# Altium project PX4FMUv2.4.6.PrjPcb (part 1 of 2)
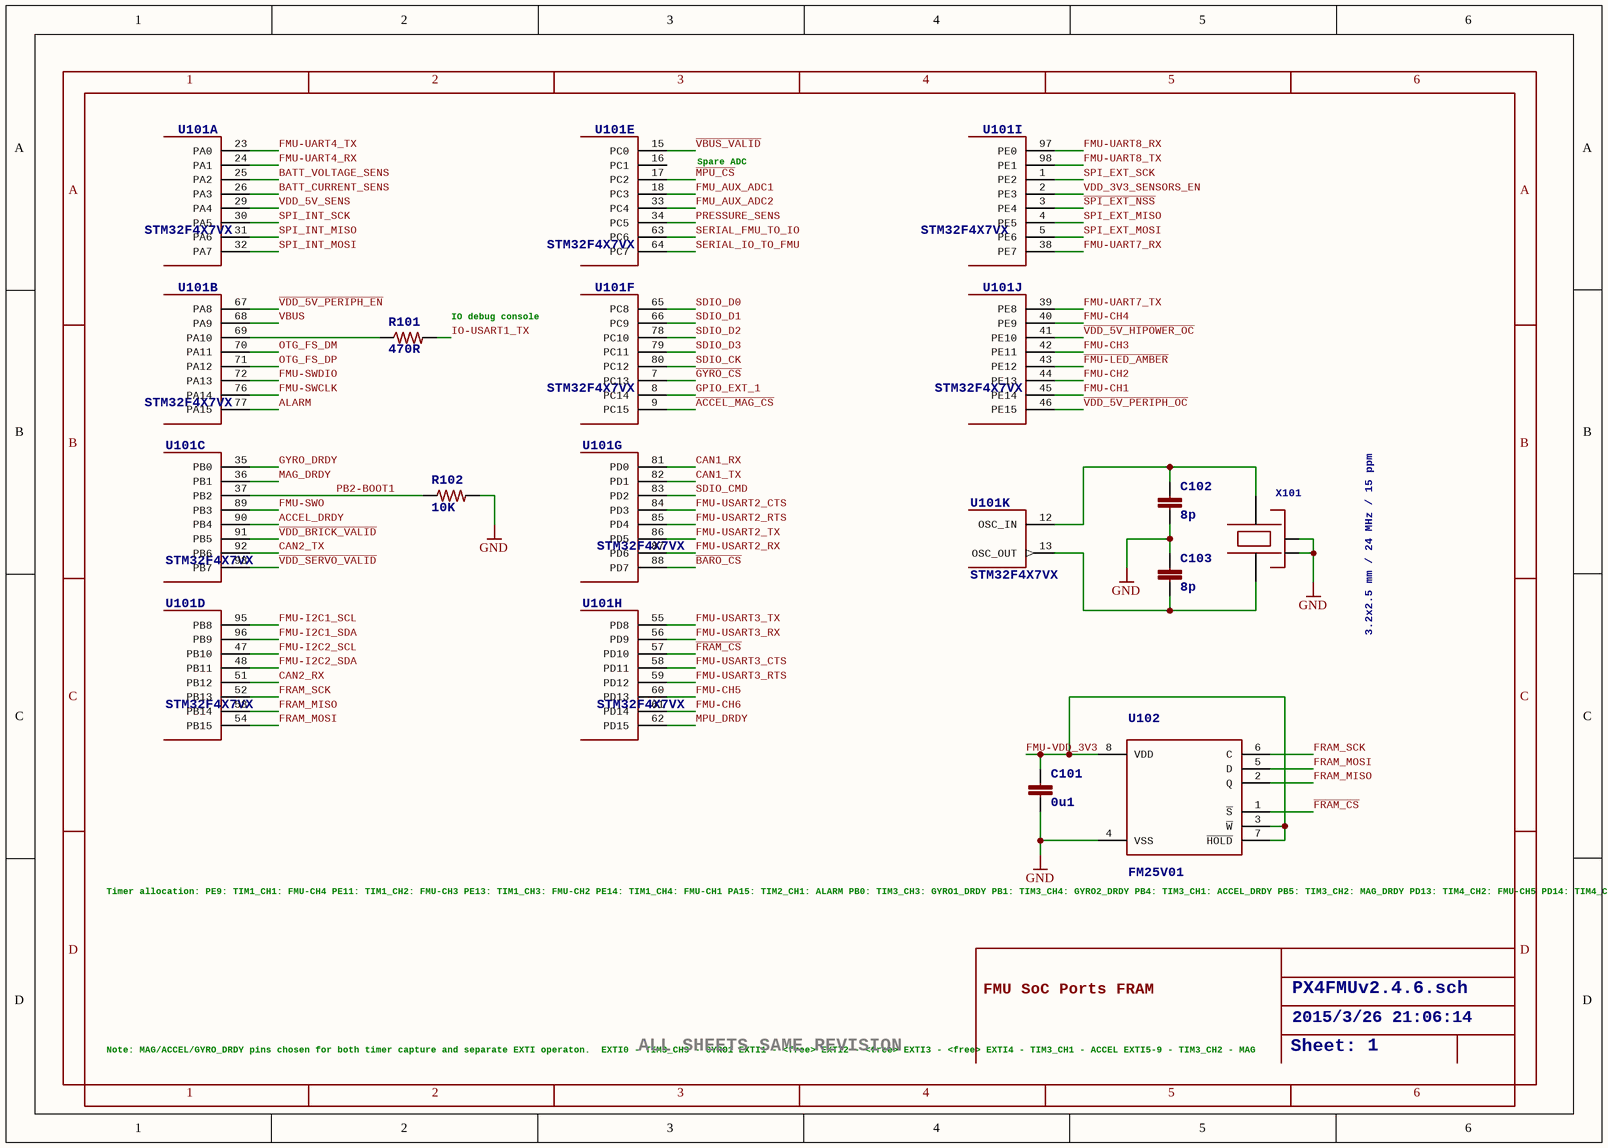
[diagram p0: PX4FMUv2.4.6_01.SchDoc]
12 sheets, 291 parts. Net scope: global (net labels, ports and power ports of the same name join across sheets).
Board file: PX4FMUv2.4.6.PcbDoc
Sheets:
  PX4FMUv2.4.6_01.SchDoc
  PX4FMUv2.4.6_02.SchDoc
  PX4FMUv2.4.6_03.SchDoc
  PX4FMUv2.4.6_04.SchDoc
  PX4FMUv2.4.6_05.SchDoc
  PX4FMUv2.4.6_06.SchDoc
  PX4FMUv2.4.6_07.SchDoc
  PX4FMUv2.4.6_08.SchDoc
  PX4FMUv2.4.6_09.SchDoc
  PX4FMUv2.4.6_10.SchDoc
  PX4FMUv2.4.6_11.SchDoc
  PX4FMUv2.4.6_12.SchDoc

## Sheet PX4FMUv2.4.6_01.SchDoc: PX4FMUv2.4.6.sch
size 282 x 200 mm; Date: 2015/3/26 21:06:14; SheetNumber: Sheet:

### Parts
C101  0u1  [0402-CAP]
C102  8p  [0402-CAP]
C103  8p  [0402-CAP]
R101  470R  [0402-RES]
R102  10K  [0402-RES]
U101  STM32F4X7VX  [TQFP100]  (parts A,B,C,D,E,F,G,H,I,J,K of 14)
U102  FM25V01  [SO08]
X101  3.2x2.5 mm / 24 MHz / 15 ppm  [OSCILLATOR-3.2X2.5]

### Nets
GND: C101.P$2 C102.P$2 C103.P$1 R102.P$2 U102.4(VSS) X101.2(NC_2) X101.4(NC_4)
~{ACCEL_MAG_CS}: U101.9(PC15)
ACCEL_DRDY: U101.90(PB4)
ALARM: U101.77(PA15)
~{BARO_CS}: U101.88(PD7)
BATT_CURRENT_SENS: U101.26(PA3)
BATT_VOLTAGE_SENS: U101.25(PA2)
CAN1_RX: U101.81(PD0)
CAN1_TX: U101.82(PD1)
CAN2_RX: U101.51(PB12)
CAN2_TX: U101.92(PB6)
~{FMU-LED_AMBER}: U101.43(PE12)
~{FRAM_CS}: U101.57(PD10) U102.1(~{S})
FMU-CH1: U101.45(PE14)
FMU-CH2: U101.44(PE13)
FMU-CH3: U101.42(PE11)
FMU-CH4: U101.40(PE9)
FMU-CH5: U101.60(PD13)
FMU-CH6: U101.61(PD14)
FMU-I2C1_SCL: U101.95(PB8)
FMU-I2C1_SDA: U101.96(PB9)
FMU-I2C2_SCL: U101.47(PB10)
FMU-I2C2_SDA: U101.48(PB11)
FMU-SWCLK: U101.76(PA14)
FMU-SWDIO: U101.72(PA13)
FMU-SWO: U101.89(PB3)
FMU-UART4_RX: U101.24(PA1)
FMU-UART4_TX: U101.23(PA0)
FMU-UART7_RX: U101.38(PE7)
FMU-UART7_TX: U101.39(PE8)
FMU-UART8_RX: U101.97(PE0)
FMU-UART8_TX: U101.98(PE1)
FMU-USART2_CTS: U101.84(PD3)
FMU-USART2_RTS: U101.85(PD4)
FMU-USART2_RX: U101.87(PD6)
FMU-USART2_TX: U101.86(PD5)
FMU-USART3_CTS: U101.58(PD11)
FMU-USART3_RTS: U101.59(PD12)
FMU-USART3_RX: U101.56(PD9)
FMU-USART3_TX: U101.55(PD8)
FMU-VDD_3V3: C101.P$1 U102.3(~{W}) U102.7(~{HOLD}) U102.8(VDD)
FMU_AUX_ADC1: U101.18(PC3)
FMU_AUX_ADC2: U101.33(PC4)
FRAM_MISO: U101.53(PB14) U102.2(Q)
FRAM_MOSI: U101.54(PB15) U102.5(D)
FRAM_SCK: U101.52(PB13) U102.6(C)
~{GYRO_CS}: U101.7(PC13)
GPIO_EXT_1: U101.8(PC14)
GYRO_DRDY: U101.35(PB0)
IO-USART1_TX: R101.P$2
~{MPU_CS}: U101.17(PC2)
MAG_DRDY: U101.36(PB1)
MPU_DRDY: U101.62(PD15)
OTG_FS_DM: U101.70(PA11)
OTG_FS_DP: U101.71(PA12)
PB2-BOOT1: R102.P$1 U101.37(PB2)
PRESSURE_SENS: U101.34(PC5)
~{SPI_EXT_NSS}: U101.3(PE4)
SDIO_CK: U101.80(PC12)
SDIO_CMD: U101.83(PD2)
SDIO_D0: U101.65(PC8)
SDIO_D1: U101.66(PC9)
SDIO_D2: U101.78(PC10)
SDIO_D3: U101.79(PC11)
SERIAL_FMU_TO_IO: U101.63(PC6)
SERIAL_IO_TO_FMU: U101.64(PC7)
SPI_EXT_MISO: U101.4(PE5)
SPI_EXT_MOSI: U101.5(PE6)
SPI_EXT_SCK: U101.1(PE2)
SPI_INT_MISO: U101.31(PA6)
SPI_INT_MOSI: U101.32(PA7)
SPI_INT_SCK: U101.30(PA5)
~{VBUS_VALID}: U101.15(PC0)
~{VDD_5V_HIPOWER_OC}: U101.41(PE10)
~{VDD_5V_PERIPH_EN}: U101.67(PA8)
~{VDD_5V_PERIPH_OC}: U101.46(PE15)
~{VDD_BRICK_VALID}: U101.91(PB5)
~{VDD_SERVO_VALID}: U101.93(PB7)
VBUS: U101.68(PA9)
VDD_3V3_SENSORS_EN: U101.2(PE3)
VDD_5V_SENS: U101.29(PA4)
NetC102_P$1: C102.P$1 U101.12(OSC_IN) X101.3
NetC103_P$2: C103.P$2 U101.13(OSC_OUT) X101.1
NetR101_P$1: R101.P$1 U101.69(PA10)

Not connected (* = marked no-connect by the designer): U101 16(PC1)

### Notes on the sheet
- Spare ADC
- (near R101) IO debug console
- (near U102) Timer allocation:
  PE9: TIM1_CH1: FMU-CH4
  PE11: TIM1_CH2: FMU-CH3
  PE13: TIM1_CH3: FMU-CH2
  PE14: TIM1_CH4: FMU-CH1
  PA15: TIM2_CH1: ALARM
  PB0: TIM3_CH3: GYRO1_DRDY
  PB1: TIM3_CH4: GYRO2_DRDY
  PB4: TIM3_CH1: ACCEL_DRDY
  PB5: TIM3_CH2: MAG_DRDY
  PD13: TIM4_CH2: FMU-CH5
  PD14: TIM4_CH3: FMU-CH6
  PD15: TIM4_CH4: spare
- FMU SoC Ports
  FRAM
- Note: MAG/ACCEL/GYRO_DRDY pins chosen
  for both timer capture and separate
  EXTI operaton.
  EXTI0 - TIM3_CH3 - GYRO1
  EXTI1 - <free>
  EXTI2 - <free>
  EXTI3 - <free>
  EXTI4 - TIM3_CH1 - ACCEL
  EXTI5-9 - TIM3_CH2 - MAG
- ALL SHEETS SAME REVISION
- 1
- 2
- 3
- 4
- 5
- 6
- A
- B
- C
- D

### Library data of the parts
C101 = CAP0402: <b>Capacitor</b> / Standard 0603 ceramic capacitor, and 0.1" leaded capacitor.; PARTNO: CC0402ZRY5V7BB104
C102 C103 = CAP0402: <b>Capacitor</b> / Standard 0603 ceramic capacitor, and 0.1" leaded capacitor.; PARTNO: C1005C0G1H080C
R101 = RESISTOR0402-RES: <b>Resistor</b> / Basic schematic elements and footprints for 0603, 1206, and PTH 1/10th watt (small) resistors.; PARTNO: RC0402FR-07470RL
R102 = RESISTOR0402-RES: <b>Resistor</b> / Basic schematic elements and footprints for 0603, 1206, and PTH 1/10th watt (small) resistors.; PARTNO: RC0402FR-0710KL
U101 = STM32F4X7VX: STM32F4X7VX 100 pin LQFP / STM32F407VE - 512 KB flash, no crypto / STM32F407VG - 1 MB flash, no crypto / STM32F417VE - 512 KB flash, with crypto / STM32F417VG - 1 MB flash, with crypto; PARTNO: STM32F427VI
U102 = FM25V01: <b>FM25V01 128Kb Serial 3V F-RAM Memory</b>; PARTNO: FM25V01-G; DATASHEET: http://www.ramtron.com/files/datasheets/FM25V01_ds.pdf; LINK: http://www.digikey.com/product-detail/en/FM25V01-GTR/1140-1026-1-ND/2809832; MFGPN: FM25V01
X101 = OSCILLATOR-3.2X2.5: Crystal Oscillator in 3.2x2.5 SMD

## Sheet PX4FMUv2.4.6_02.SchDoc: PX4FMUv2.4.6.sch
size 282 x 200 mm; Date: 2015/3/26 21:06:15; SheetNumber: Sheet:
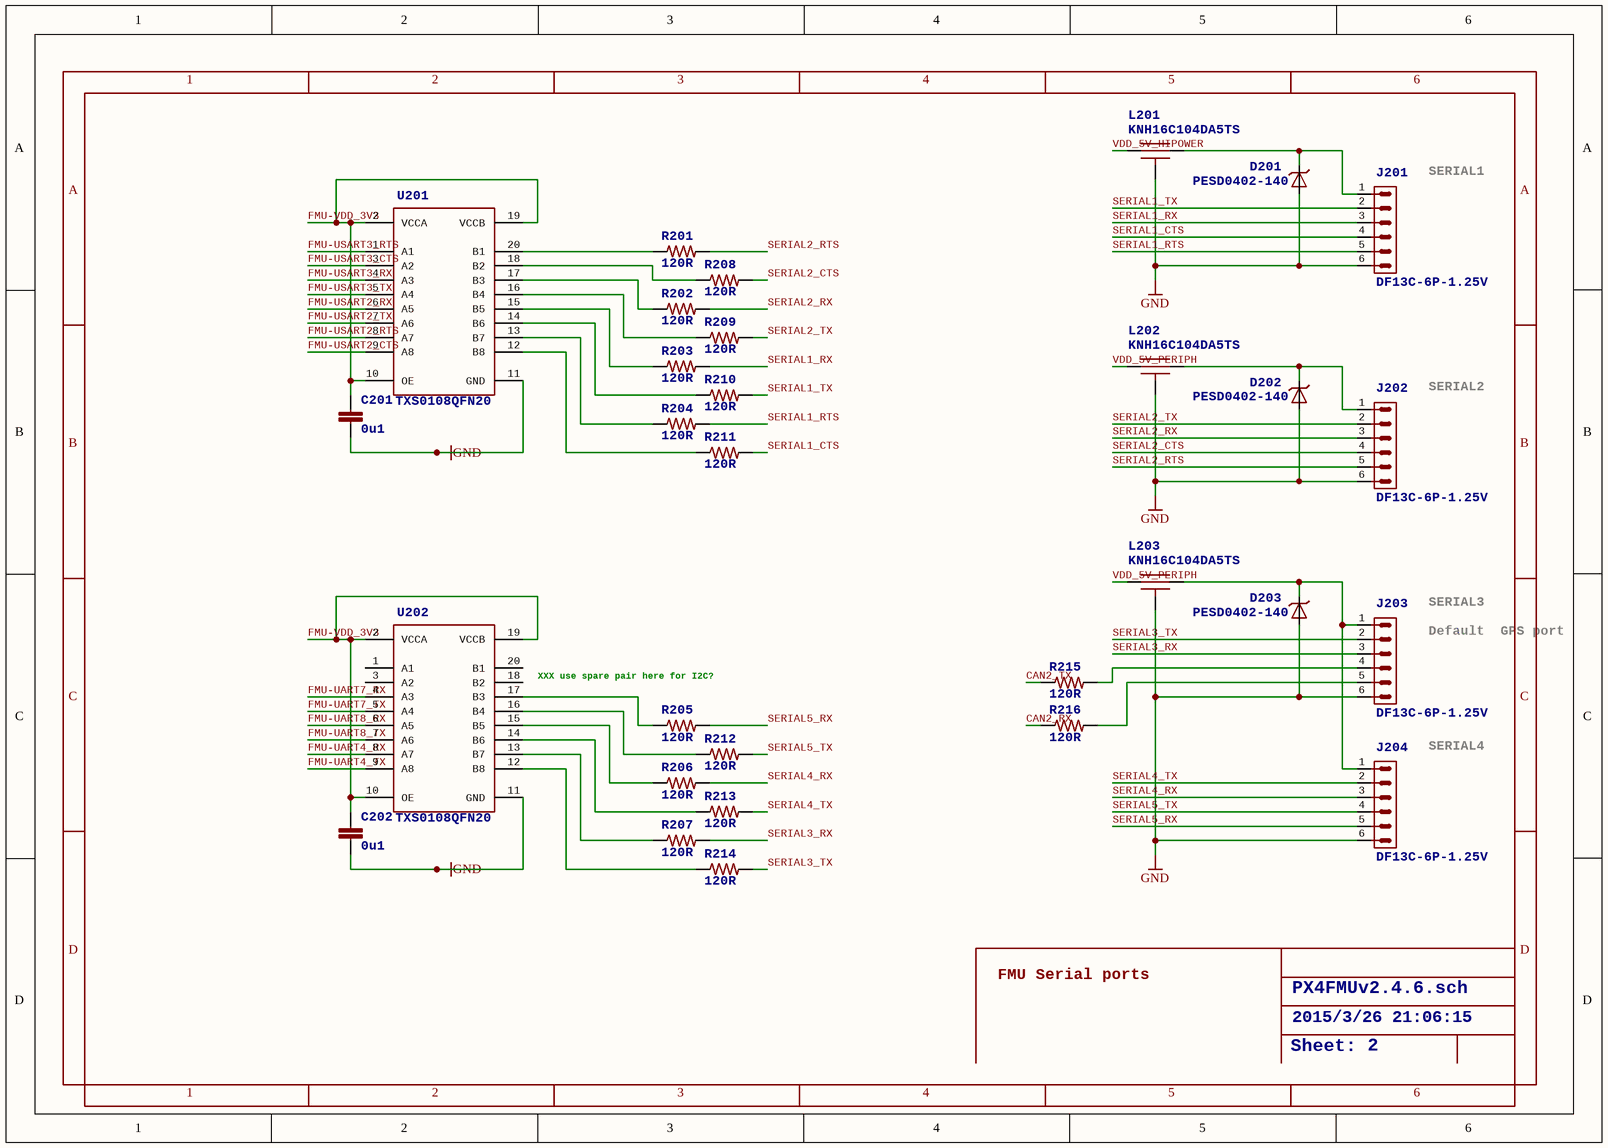
[diagram p1: PX4FMUv2.4.6_02.SchDoc]

### Parts
C201  0u1  [0402-CAP]
C202  0u1  [0402-CAP]
D201  PESD0402-140  [0402-TVS]
D202  PESD0402-140  [0402-TVS]
D203  PESD0402-140  [0402-TVS]
J201  DF13C-6P-1.25V  [DF13C-6P-1.25V]
J202  DF13C-6P-1.25V  [DF13C-6P-1.25V]
J203  DF13C-6P-1.25V  [DF13C-6P-1.25V]
J204  DF13C-6P-1.25V  [DF13C-6P-1.25V]
L201  KNH16C104DA5TS  [KYOCERA-KNH16-DA]
L202  KNH16C104DA5TS  [KYOCERA-KNH16-DA]
L203  KNH16C104DA5TS  [KYOCERA-KNH16-DA]
R201  120R  [0402-RES]
R202  120R  [0402-RES]
R203  120R  [0402-RES]
R204  120R  [0402-RES]
R205  120R  [0402-RES]
R206  120R  [0402-RES]
R207  120R  [0402-RES]
R208  120R  [0402-RES]
R209  120R  [0402-RES]
R210  120R  [0402-RES]
R211  120R  [0402-RES]
R212  120R  [0402-RES]
R213  120R  [0402-RES]
R214  120R  [0402-RES]
R215  120R  [0402-RES]
R216  120R  [0402-RES]
U201  TXS0108QFN20  [QFN20-RGY]
U202  TXS0108QFN20  [QFN20-RGY]

### Nets
GND: C201.P$2 C202.P$2 D201.A D202.A D203.A J201.6 J202.6 J203.6 J204.6 L201.P$3_P$4_P$5(P$3) L202.P$3_P$4_P$5(P$3) L203.P$3_P$4_P$5(P$3) U201.11(GND) U202.11(GND)
CAN2_RX: R216.P$1
CAN2_TX: R215.P$1
FMU-UART4_RX: U202.8(A7)
FMU-UART4_TX: U202.9(A8)
FMU-UART7_RX: U202.4(A3)
FMU-UART7_TX: U202.5(A4)
FMU-UART8_RX: U202.6(A5)
FMU-UART8_TX: U202.7(A6)
FMU-USART2_CTS: U201.9(A8)
FMU-USART2_RTS: U201.8(A7)
FMU-USART2_RX: U201.6(A5)
FMU-USART2_TX: U201.7(A6)
FMU-USART3_CTS: U201.3(A2)
FMU-USART3_RTS: U201.1(A1)
FMU-USART3_RX: U201.4(A3)
FMU-USART3_TX: U201.5(A4)
FMU-VDD_3V3: C201.P$1 C202.P$1 U201.2(VCCA) U201.10(OE) U201.19(VCCB) U202.2(VCCA) U202.10(OE) U202.19(VCCB)
SERIAL1_CTS: J201.4 R211.P$2
SERIAL1_RTS: J201.5 R204.P$2
SERIAL1_RX: J201.3 R203.P$2
SERIAL1_TX: J201.2 R210.P$2
SERIAL2_CTS: J202.4 R208.P$2
SERIAL2_RTS: J202.5 R201.P$2
SERIAL2_RX: J202.3 R202.P$2
SERIAL2_TX: J202.2 R209.P$2
SERIAL3_RX: J203.3 R207.P$2
SERIAL3_TX: J203.2 R214.P$2
SERIAL4_RX: J204.3 R206.P$2
SERIAL4_TX: J204.2 R213.P$2
SERIAL5_RX: J204.5 R205.P$2
SERIAL5_TX: J204.4 R212.P$2
VDD_5V_HIPOWER: L201.P$1
VDD_5V_PERIPH: L202.P$1 L203.P$1
NetD201_C: D201.C J201.1 L201.P$2
NetD202_C: D202.C J202.1 L202.P$2
NetD203_C: D203.C J203.1 J204.1 L203.P$2
NetJ203_4: J203.4 R215.P$2
NetJ203_5: J203.5 R216.P$2
NetR201_P$1: R201.P$1 U201.20(B1)
NetR202_P$1: R202.P$1 U201.17(B3)
NetR203_P$1: R203.P$1 U201.15(B5)
NetR204_P$1: R204.P$1 U201.13(B7)
NetR205_P$1: R205.P$1 U202.17(B3)
NetR206_P$1: R206.P$1 U202.15(B5)
NetR207_P$1: R207.P$1 U202.13(B7)
NetR208_P$1: R208.P$1 U201.18(B2)
NetR209_P$1: R209.P$1 U201.16(B4)
NetR210_P$1: R210.P$1 U201.14(B6)
NetR211_P$1: R211.P$1 U201.12(B8)
NetR212_P$1: R212.P$1 U202.16(B4)
NetR213_P$1: R213.P$1 U202.14(B6)
NetR214_P$1: R214.P$1 U202.12(B8)

Not connected (* = marked no-connect by the designer): U202 1(A1) 3(A2) 18(B2) 20(B1)

### Notes on the sheet
- SERIAL1
- SERIAL2
- SERIAL3
- Default
  GPS port
- XXX use spare pair here for I2C?
- SERIAL4
- FMU Serial ports
- 1
- 2
- 3
- 4
- 5
- 6
- A
- B
- C
- D

### Library data of the parts
C201 C202 = CAP0402: as C101 on sheet PX4FMUv2.4.6_01
D201-D203 = DIODE-TVS
J201-J204 = DF13-6P-1.25V: DF13-6P / 1.25mm Pitch Miniature Crimping Connector.; PARTNO: DF13C-6P-1.25V(20)
L201-L203 = KNH16C104DA5TS: Kyocera KNH16C104DA5TS EMI filter; PARTNO: KNH16C104DA5TS
R201-R216 = RESISTOR0402-RES: <b>Resistor</b> / Basic schematic elements and footprints for 0603, 1206, and PTH 1/10th watt (small) resistors.; PARTNO: RC0402FR-07120RL
U201 U202 = TXS0108QFN20: PARTNO: TXS0108ERGYR

## Sheet PX4FMUv2.4.6_03.SchDoc: PX4FMUv2.4.6.sch
size 282 x 200 mm; Date: 2015/3/26 21:06:16; SheetNumber: Sheet:
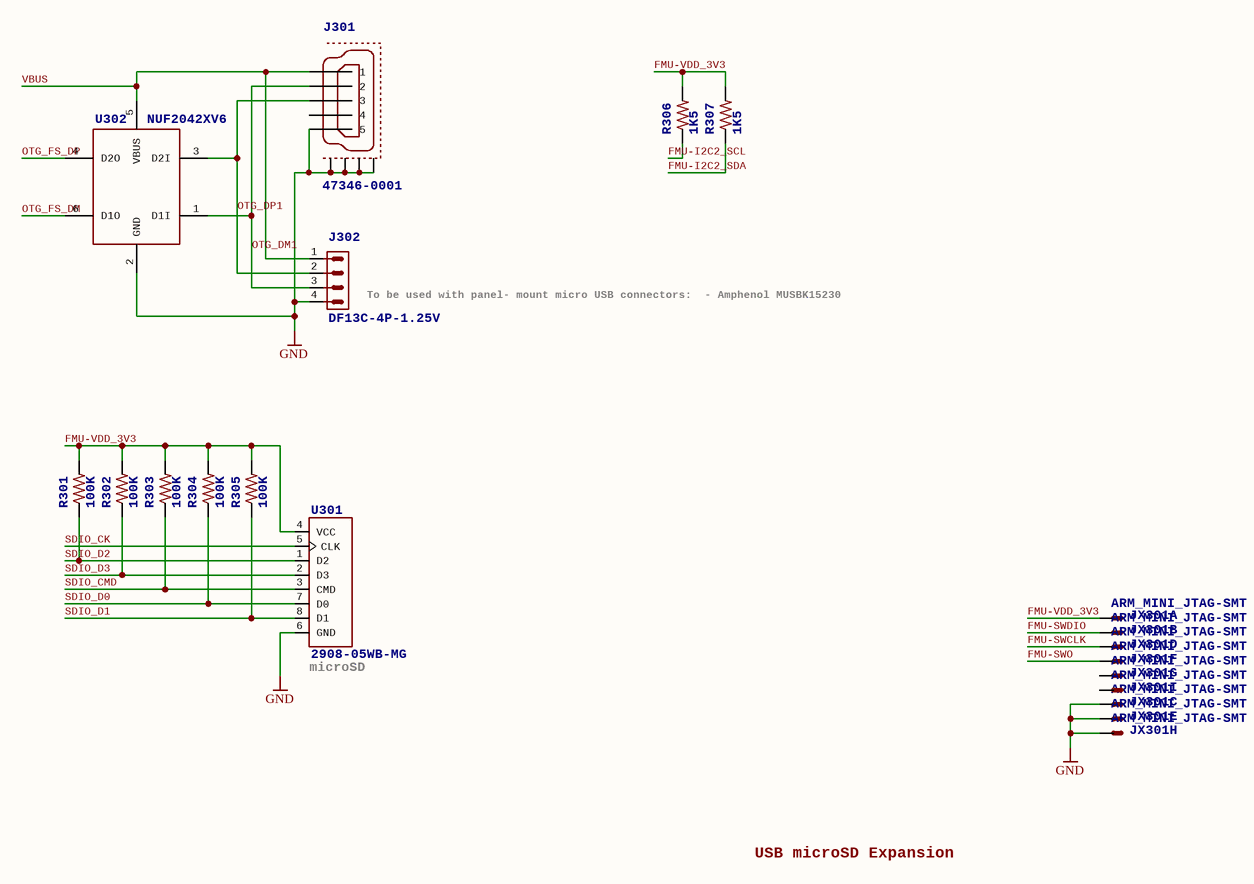
[diagram p2: PX4FMUv2.4.6_03.SchDoc]

### Parts
J301  47346-0001  [MOLEX-47346-0001]
J302  DF13C-4P-1.25V  [DF13C-4P-1.25V]
JX301  ARM_MINI_JTAG-SMT  [FTSH-105-01-XXX-DV-K]  (parts A,B,C,D,E,F,G,H,I of 9)
R301  100K  [0402-RES]
R302  100K  [0402-RES]
R303  100K  [0402-RES]
R304  100K  [0402-RES]
R305  100K  [0402-RES]
R306  1K5  [0402-RES]
R307  1K5  [0402-RES]
U301  2908-05WB-MG  [MICROSD]
U302  NUF2042XV6  [SOT563-6]

### Nets
GND: J301.GND(5) J301.GND1 J301.GND2 J301.GND3 J301.GND4 J302.4 JX301.3(S) JX301.5(S) JX301.9(S) U301.6(GND) U302.2(GND)
FMU-I2C2_SCL: R306.P$1
FMU-I2C2_SDA: R307.P$1
FMU-SWCLK: JX301.4(S)
FMU-SWDIO: JX301.2(S)
FMU-SWO: JX301.6(S)
FMU-VDD_3V3: JX301.1(S) R301.P$2 R302.P$2 R303.P$2 R304.P$2 R305.P$2 R306.P$2 R307.P$2 U301.4(VCC)
OTG_DM1: J301.D-(2) J302.3 U302.1(D1I)
OTG_DP1: J301.D+(3) J302.2 U302.3(D2I)
OTG_FS_DM: U302.6(D1O)
OTG_FS_DP: U302.4(D2O)
SDIO_CK: U301.5(CLK)
SDIO_CMD: R303.P$1 U301.3(CMD)
SDIO_D0: R304.P$1 U301.7(D0)
SDIO_D1: R305.P$1 U301.8(D1)
SDIO_D2: R301.P$1 U301.1(D2)
SDIO_D3: R302.P$1 U301.2(D3)
VBUS: J301.VBUS(1) J302.1 U302.5(VBUS)

Not connected (* = marked no-connect by the designer): J301 ID(4); JX301 8(S) 10(S)

### Notes on the sheet
- (near J302) To be used with panel-
  mount micro USB connectors:
  - Amphenol MUSBK15230
- (near U301) microSD
- USB
  microSD
  Expansion
- 1
- 2
- 3
- 4
- 5
- 6
- A
- B
- C
- D

### Library data of the parts
J301 = MOLEX-47346-0001: MICRO USB B, BOTTOM MOUNT
J302 = DF13-4P-1.25V: DF13-4P / 1.25mm Pitch Miniature Crimping Connector.; PARTNO: DF13C-4P-1.25V(20)
JX301 = ARM_MINI_JTAG-SMT: <b>CONNECTOR</b><p> / wire to board 1.25 mm (.049 inch) pitch header; PARTNO: M50-3900542; BOM: EXCLUDE
R301-R305 = RESISTOR0402-RES: <b>Resistor</b> / Basic schematic elements and footprints for 0603, 1206, and PTH 1/10th watt (small) resistors.; PARTNO: RC0402FR-07100KL
R306 R307 = RESISTOR0402-RES: <b>Resistor</b> / Basic schematic elements and footprints for 0603, 1206, and PTH 1/10th watt (small) resistors.; PARTNO: RC0402FR-071K5L
U301 = MICROSDSDI: PARTNO: 2908-05WB-MG
U302 = NUF2042XV6: PARTNO: NUF2042XV6T1G

## Sheet PX4FMUv2.4.6_04.SchDoc: PX4FMUv2.4.6.sch
size 282 x 200 mm; Date: 2015/3/26 21:06:17; SheetNumber: Sheet:
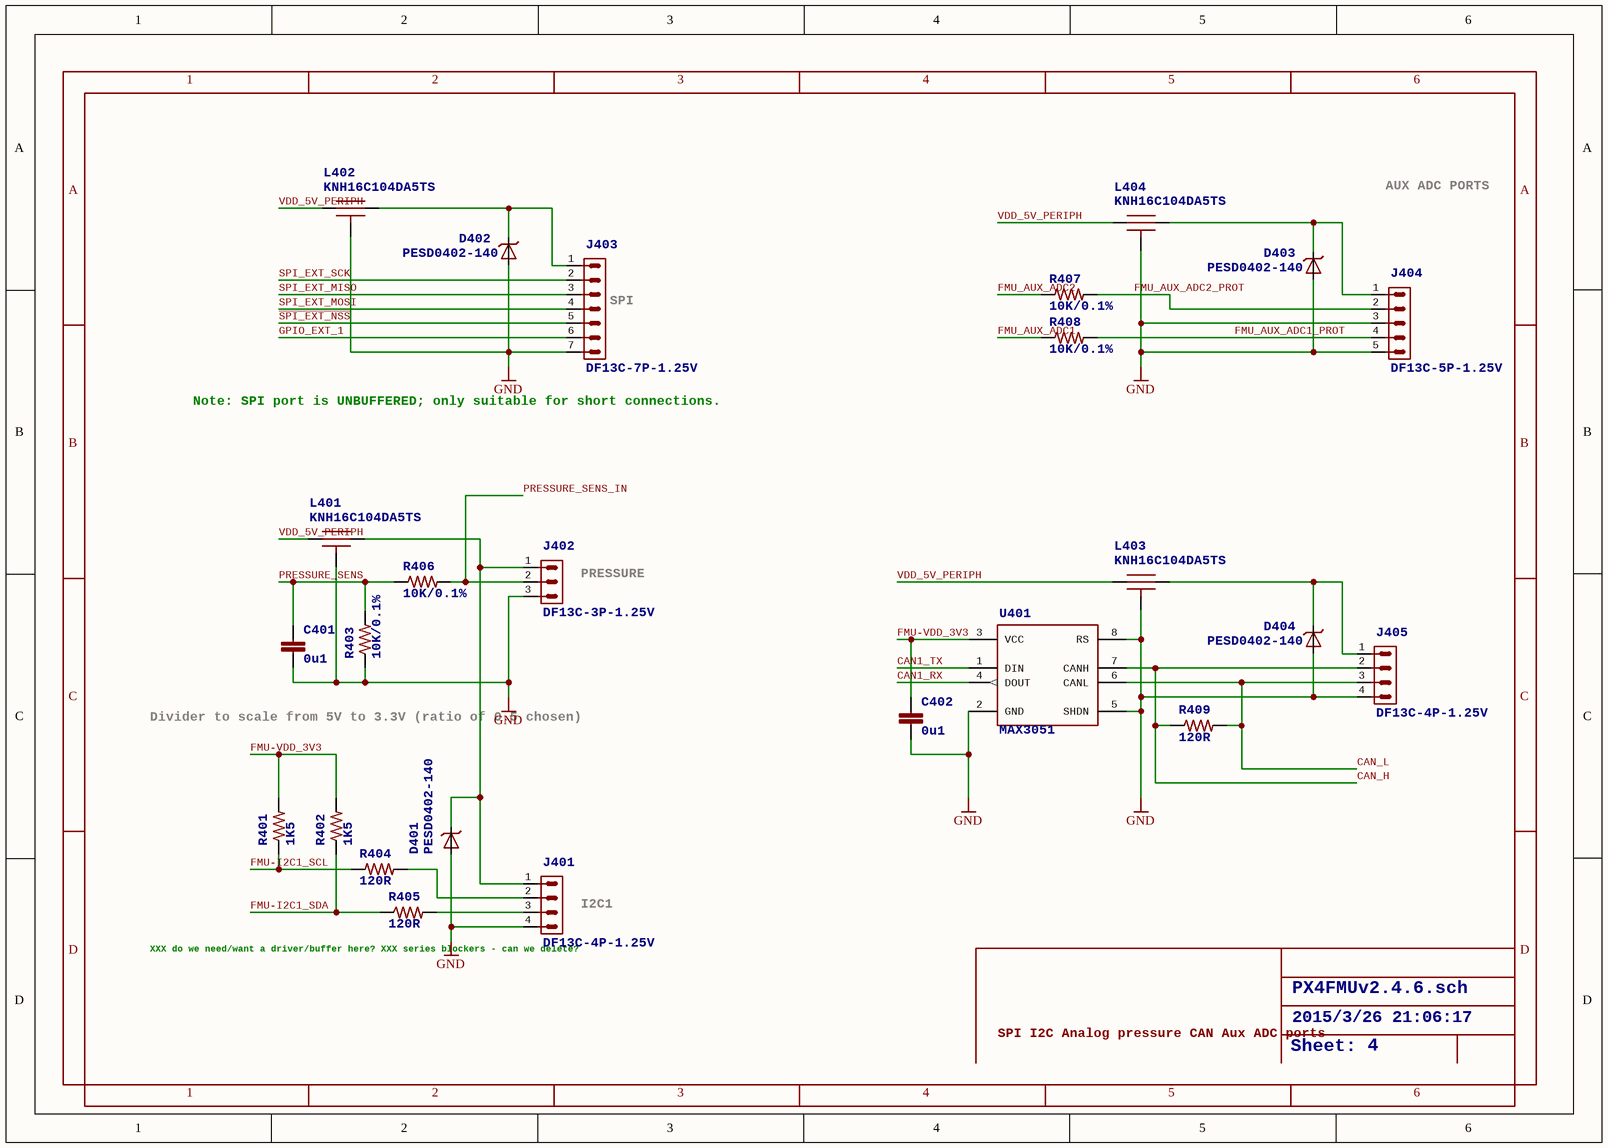
[diagram p3: PX4FMUv2.4.6_04.SchDoc]

### Parts
C401  0u1  [0402-CAP]
C402  0u1  [0402-CAP]
D401  PESD0402-140  [0402-TVS]
D402  PESD0402-140  [0402-TVS]
D403  PESD0402-140  [0402-TVS]
D404  PESD0402-140  [0402-TVS]
J401  DF13C-4P-1.25V  [DF13C-4P-1.25V]
J402  DF13C-3P-1.25V  [DF13C-3P-1.25V]
J403  DF13C-7P-1.25V  [DF13C-7P-1.25V]
J404  DF13C-5P-1.25V  [DF13C-5P-1.25V]
J405  DF13C-4P-1.25V  [DF13C-4P-1.25V]
L401  KNH16C104DA5TS  [KYOCERA-KNH16-DA]
L402  KNH16C104DA5TS  [KYOCERA-KNH16-DA]
L403  KNH16C104DA5TS  [KYOCERA-KNH16-DA]
L404  KNH16C104DA5TS  [KYOCERA-KNH16-DA]
R401  1K5  [0402-RES]
R402  1K5  [0402-RES]
R403  10K/0.1%  [0402-RES]
R404  120R  [0402-RES]
R405  120R  [0402-RES]
R406  10K/0.1%  [0402-RES]
R407  10K/0.1%  [0402-RES]
R408  10K/0.1%  [0402-RES]
R409  120R  [0402-RES]
U401  MAX3051  [SOT23-8]

### Nets
GND: C401.P$2 C402.P$2 D401.A D402.A D403.A D404.A J401.4 J402.3 J403.7 J404.3 J404.5 J405.4 L401.P$3_P$4_P$5(P$3) L402.P$3_P$4_P$5(P$3) L403.P$3_P$4_P$5(P$3) L404.P$3_P$4_P$5(P$3) R403.P$1 U401.2(GND) U401.5(SHDN) U401.8(RS)
CAN1_RX: U401.4(DOUT)
CAN1_TX: U401.1(DIN)
CAN_H: J405.2 R409.P$1 U401.7(CANH)
CAN_L: J405.3 R409.P$2 U401.6(CANL)
FMU-I2C1_SCL: R401.P$1 R404.P$1
FMU-I2C1_SDA: R402.P$1 R405.P$1
FMU-VDD_3V3: C402.P$1 R401.P$2 R402.P$2 U401.3(VCC)
FMU_AUX_ADC1: R408.P$1
FMU_AUX_ADC1_PROT: J404.4 R408.P$2
FMU_AUX_ADC2: R407.P$1
FMU_AUX_ADC2_PROT: J404.2 R407.P$2
GPIO_EXT_1: J403.6
PRESSURE_SENS: C401.P$1 R403.P$2 R406.P$1
PRESSURE_SENS_IN: J402.2 R406.P$2
~{SPI_EXT_NSS}: J403.5
SPI_EXT_MISO: J403.3
SPI_EXT_MOSI: J403.4
SPI_EXT_SCK: J403.2
VDD_5V_PERIPH: L401.P$1 L402.P$1 L403.P$1 L404.P$1
NetD401_C: D401.C J401.1 J402.1 L401.P$2
NetD402_C: D402.C J403.1 L402.P$2
NetD403_C: D403.C J404.1 L404.P$2
NetD404_C: D404.C J405.1 L403.P$2
NetJ401_2: J401.2 R404.P$2
NetJ401_3: J401.3 R405.P$2

### Notes on the sheet
- AUX ADC PORTS
- (near J403) SPI
- (near J403) Note: SPI port is UNBUFFERED; only suitable for short connections.
- (near J402) PRESSURE
- Divider to scale from 5V to 3.3V
  (ratio of 0.5 chosen)
- XXX do we need/want a driver/buffer here?
  XXX series blockers - can we delete?
- (near J401) I2C1
- SPI
  I2C
  Analog pressure
  CAN
  Aux ADC ports
- 1
- 2
- 3
- 4
- 5
- 6
- A
- B
- C
- D

### Library data of the parts
C401 C402 = CAP0402: as C101 on sheet PX4FMUv2.4.6_01
D401-D404 = DIODE-TVS
J401 J405 = DF13-4P-1.25V: as J302 on sheet PX4FMUv2.4.6_03
J402 = DF13-3P-1.25V: DF13-3P / 1.25mm Pitch Miniature Crimping Connector.; PARTNO: DF13C-3P-1.25V(20)
J403 = DF13-7P-1.25V: DF13-7P / 1.25mm Pitch Miniature Crimping Connector.; PARTNO: DF13C-7P-1.25V(20)
J404 = DF13-5P-1.25V: DF13-5P / 1.25mm Pitch Miniature Crimping Connector.; PARTNO: DF13C-5P-1.25V(20)
L401-L404 = KNH16C104DA5TS: Kyocera KNH16C104DA5TS EMI filter; PARTNO: KNH16C104DA5TS
R401 R402 = RESISTOR0402-RES: as R306 on sheet PX4FMUv2.4.6_03
R403 R406-R408 = RESISTOR0402-RES: <b>Resistor</b> / Basic schematic elements and footprints for 0603, 1206, and PTH 1/10th watt (small) resistors.; PARTNO: ERA-2AEB103X
R404 R405 R409 = RESISTOR0402-RES: as R201 on sheet PX4FMUv2.4.6_02
U401 = MAX3051MAX3051EKA: 3.3-V CAN TRANSCEIVER; PARTNO: MAX3051EKA

## Sheet PX4FMUv2.4.6_05.SchDoc: PX4FMUv2.4.6.sch
size 282 x 200 mm; Date: 2015/3/26 21:06:18; SheetNumber: Sheet:
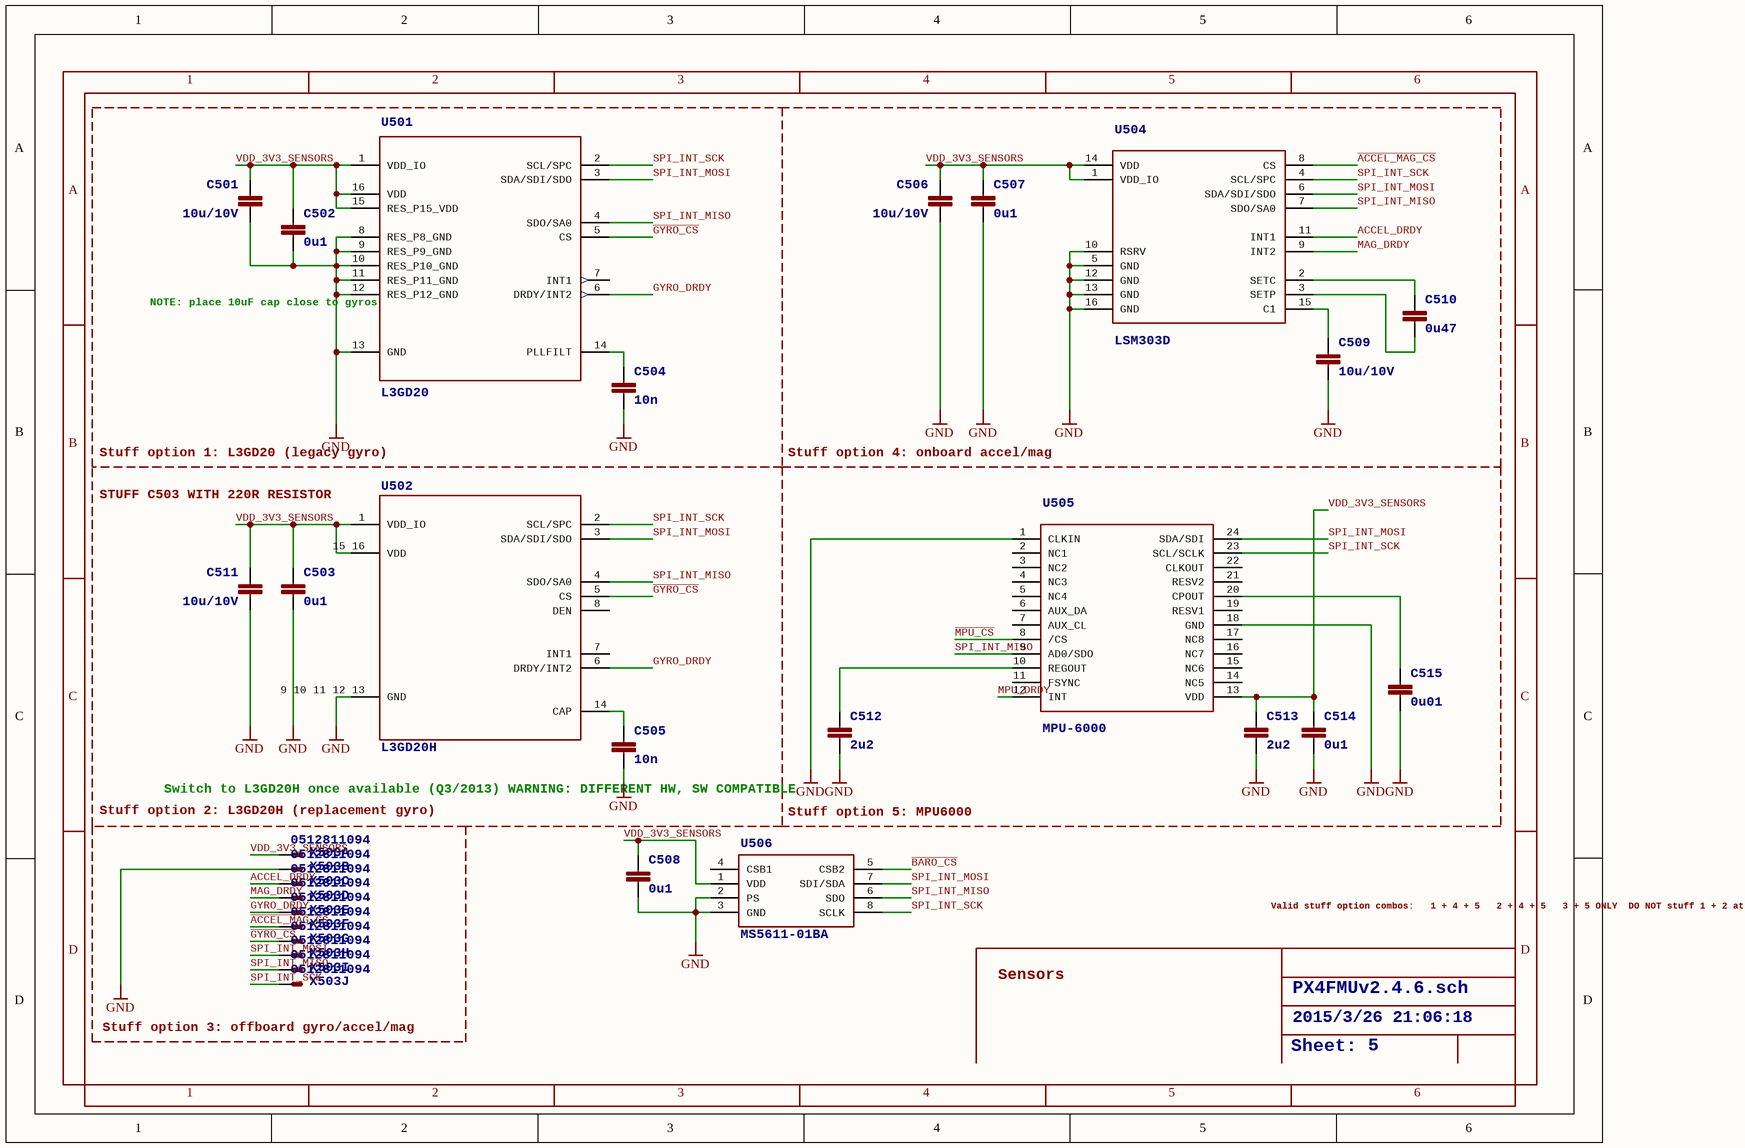
[diagram p4: PX4FMUv2.4.6_05.SchDoc]

### Parts
C501  10u/10V  [0805-CAP]
C502  0u1  [0402-CAP]
C503  0u1  [0402-CAP]
C504  10n  [0402-CAP]
C505  10n  [0402-CAP]
C506  10u/10V  [0805-CAP]
C507  0u1  [0402-CAP]
C508  0u1  [0402-CAP]
C509  10u/10V  [0805-CAP]
C510  0u47  [0402-CAP]
C511  10u/10V  [0805-CAP]
C512  2u2  [0603-CAP]
C513  2u2  [0603-CAP]
C514  0u1  [0402-CAP]
C515  0u01  [0603-CAP]
U501  L3GD20  [L3G4200DH-MAN]
U502  L3GD20H  [LGA-16L]
U504  LSM303D  [LGA-16L]
U505  MPU-6000  [QFN-24]
U506  MS5611-01BA  [MS5611-01BA]
X503  0512811094  [51281-1094]  (parts A,B,C,D,E,F,G,H,I,J of 10)

### Nets
GND: C501.P$2 C502.P$2 C503.P$2 C504.P$2 C505.P$2 C506.P$2 C507.P$2 C508.P$2 C509.P$2 C511.P$2 C512.P$2 C513.P$2 C514.P$2 C515.P$2 U501.8(RES_P8_GND) U501.9(RES_P9_GND) U501.10(RES_P10_GND) U501.11(RES_P11_GND) U501.12(RES_P12_GND) U501.13(GND) U502.9_10_11_12_13(GND) U504.5(GND) U504.10(RSRV) U504.12(GND) U504.13(GND) U504.16(GND) U505.1(CLKIN) U505.18(GND) U506.2(PS) U506.3(GND) X503.2(S)
~{ACCEL_MAG_CS}: U504.8(CS) X503.6(S)
ACCEL_DRDY: U504.11(INT1) X503.3(S)
~{BARO_CS}: U506.5(CSB2)
~{GYRO_CS}: U501.5(CS) U502.5(CS) X503.7(S)
GYRO_DRDY: U501.6(DRDY/INT2) U502.6(DRDY/INT2) X503.5(S)
~{MPU_CS}: U505.8(/CS)
MAG_DRDY: U504.9(INT2) X503.4(S)
MPU_DRDY: U505.12(INT)
SPI_INT_MISO: U501.4(SDO/SA0) U502.4(SDO/SA0) U504.7(SDO/SA0) U505.9(AD0/SDO) U506.6(SDO) X503.9(S)
SPI_INT_MOSI: U501.3(SDA/SDI/SDO) U502.3(SDA/SDI/SDO) U504.6(SDA/SDI/SDO) U505.24(SDA/SDI) U506.7(SDI/SDA) X503.8(S)
SPI_INT_SCK: U501.2(SCL/SPC) U502.2(SCL/SPC) U504.4(SCL/SPC) U505.23(SCL/SCLK) U506.8(SCLK) X503.10(S)
VDD_3V3_SENSORS: C501.P$1 C502.P$1 C503.P$1 C506.P$1 C507.P$1 C508.P$1 C511.P$1 C513.P$1 C514.P$1 U501.1(VDD_IO) U501.15(RES_P15_VDD) U501.16(VDD) U502.1(VDD_IO) U502.15_16(VDD) U504.1(VDD_IO) U504.14(VDD) U505.13(VDD) U506.1(VDD) X503.1(S)
NetC504_P$1: C504.P$1 U501.14(PLLFILT)
NetC505_P$1: C505.P$1 U502.14(CAP)
NetC509_P$1: C509.P$1 U504.15(C1)
NetC510_P$1: C510.P$1 U504.2(SETC)
NetC510_P$2: C510.P$2 U504.3(SETP)
NetC512_P$1: C512.P$1 U505.10(REGOUT)
NetC515_P$1: C515.P$1 U505.20(CPOUT)

Not connected (* = marked no-connect by the designer): U501 7(INT1); U502 7(INT1) 8(DEN); U505 2(NC1) 3(NC2) 4(NC3) 5(NC4) 6(AUX_DA) 7(AUX_CL) 11(FSYNC) 14(NC5) 15(NC6) 16(NC7) 17(NC8) 19(RESV1) 21(RESV2) 22(CLKOUT); U506 4(CSB1)

### Notes on the sheet
- NOTE: place 10uF cap
  close to gyros
- Stuff option 1: L3GD20 (legacy gyro)
- STUFF C503 WITH 220R RESISTOR
- Stuff option 4: onboard accel/mag
- (near C505) Switch to L3GD20H
  once available (Q3/2013)
  WARNING: DIFFERENT HW,
  SW COMPATIBLE
- (near X503) Stuff option 2: L3GD20H (replacement gyro)
- Stuff option 5: MPU6000
- Valid stuff option combos:
  1 + 4 + 5
  2 + 4 + 5
  3 + 5 ONLY
  DO NOT stuff 1 + 2 at the same time
  DO NOT stuff 3 with any of 1, 2 or 4
- Sensors
- (near X503) Stuff option 3: offboard gyro/accel/mag
- 1
- 2
- 3
- 4
- 5
- 6
- A
- B
- C
- D

### Library data of the parts
C501 C506 C509 C511 = CAP0805: <b>Capacitor</b> / Standard 0603 ceramic capacitor, and 0.1" leaded capacitor.; PARTNO: CC0805ZKY5V6BB106
C502 C503 C507 C508 C514 = CAP0402: as C101 on sheet PX4FMUv2.4.6_01
C504 C505 = CAP0402: <b>Capacitor</b> / Standard 0603 ceramic capacitor, and 0.1" leaded capacitor.; PARTNO: CC0402KRX7R7BB103
C510 = CAP0402: <b>Capacitor</b> / Standard 0603 ceramic capacitor, and 0.1" leaded capacitor.; PARTNO: C1005X5R1C474K050BC
C512 C513 = CAP0603: <b>Capacitor</b> / Standard 0603 ceramic capacitor, and 0.1" leaded capacitor.; PARTNO: C1608X6S1C225K080AC
C515 = CAP0603: <b>Capacitor</b> / Standard 0603 ceramic capacitor, and 0.1" leaded capacitor.; PARTNO: 06033C103JAT2A
U501 = L3G4200DH-LL: <h3>L3G4200DH - Digital 3-axis Gyroscope</h3> / The L3G4200DH is a low-power three-axis / angular rate sensor. The L3G4200DH has a full scale of ±250/±500/ / ±2000 dps and is capable of measuring rates with / a user-selectable bandwidth. It can operate within a / temperature range from -40 °C to +85 °C. Supply voltage: 2.4 V to 3.6 V. Full datasheet:<br /><br /> / <a href="http://www.st.com/stonline/products/literature/ds/17300.pdf">L3G4200DH Datasheet</a>; PARTNO: L3GD20
U502 = L3GD20H: <b>L3GD20H MEMS motion sensor: 3-axis digital output gyroscope</b>; BOM: EXCLUDE; DATASHEET: http://www.st.com/internet/com/TECHNICAL_RESOURCES/TECHNICAL_LITERATURE/DATASHEET/DM00060659.pdf; LINK: http://www.st.com/internet/analog/product/254039.jsp; MFGPN: L3GD20H; PARTNO: L3GD20H
U504 = LSM303D: <b>LSM303D Ultra compact high performance e-compass: 3D accelerometer and 3D magnetometer module</b>; DATASHEET: http://www.st.com/internet/com/TECHNICAL_RESOURCES/TECHNICAL_LITERATURE/DATASHEET/DM00057547.pdf; LINK: http://www.st.com/internet/analog/product/253884.jsp; MFGPN: LSM303D; PARTNO: LSM303D
U505 = MPU-6000: <b>Invensense MPU-6000: 3-axis gyro, 3-axis accel & 9-axis MotionFusion</b> / <br> / <br> / The MPU-60X0 Motion Processing Unit (MPU?) is the world?s first motion processing solution with / integrated 9-axis sensor fusion for handset and tablet applications, game controllers, motion pointer remote / controls, and other consumer devices. The MPU-60X0 has an embedded 3-axis MEMS gyroscope, 3-axis / MEMS accelerometer and Digital Motion Processor? (DMP) hardware accelerator engine with an auxiliary / I / 2 / C port that interfaces to third party digital sensors, such as magnetometers. Interfacing with a 3-axis / magnetometer delivers a complete 9-axis sensor fusion output to the MPU?s primary I / 2 / C or SPI port. (SPI is / available on MPU-6000 only). This combines acceleration and rotational motion plus heading information into / a single data stream for the application; DATASHEET: http://invensense.com/mems/gyro/documents/PS-MPU-6000A-00_v1.0.pdf; LINK: http://invensense.com/mems/gyro/mpu6000.html; MFGPN: MPU-6000; PARTNO: MPU-6000
U506 = MS5611-01BA: <b>MS5611-01BA</b> / <p>The MS5611-01BA is a new generation of high resolution altimeter sensors from MEAS Switzerland with SPI / and I / 2 / C bus interface. It is optimized for altimeters and  variometers with an altitude resolution of 10 cm. The / sensor module includes a high linearity pressure sensor and an ultra low power 24 bit ?? ADC with internal / factory calibrated coefficients. It provides a precise digital 24 Bit pressure and temperature value and different / operation modes that allow the user to optimize for conversion speed and current consumption. A high / resolution temperature output allows the implementation of an altimeter/thermometer function without any / additional sensor. The MS5611-01BA can be interfaced to virtually any microcontroller. The communication / protocol is simple, without the need of programming internal registers in the device. Small dimensions of only / 5.0 mm x 3.0 mm and a height of 1.7 mm allow for integration in mobile devices. This new sensor module / generation is based on leading MEMS technology and latest benefits from  MEAS Switzerland proven / experience and know-how in high volume manufacturing of altimeter modules, which have been widely used for / over a decade. The sensing principle employed leads to very low hysteresis and high stability of both pressure / and temperature signal.</p> / <ul> / <li>High resolution module, 10 cm </li> / <li>Fast conversion down to 1 ms </li> / <li>Low power, 1 µA (standby < 0.15 µA) </li> / <li>QFN package 5.0 x 3.0 x 1.7 mm3</li> / <li>Supply voltage 1.8 to 3.6 V </li> / <li>Integrated digital pressure sensor (24 bit ?? ADC) </li> / <li>Operating range: 10 to 1200 mbar, -40 to +85 °C </li> / <li>I2C and SPI interface up to 20 MHz </li> / <li>No external components (Internal oscillator) </li> / <li>Excellent long term stability</li> / </ul>; DATASHEET: http://www.meas-spec.com/downloads/MS5611-01BA01.pdf; LINK: http://www.meas-spec.com/product/t_product.aspx?id=8503#; MFGPN: MS5611-01BA; PARTNO: MS5611-01BA
X503 = CONN_FPC_10RA: 10-pin FPC connector for PX4 sensor board; PARTNO: 0781191109; BOM: EXCLUDE

## Sheet PX4FMUv2.4.6_06.SchDoc: PX4FMUv2.4.6.sch
size 282 x 200 mm; Date: 2015/3/26 21:06:19; SheetNumber: Sheet:
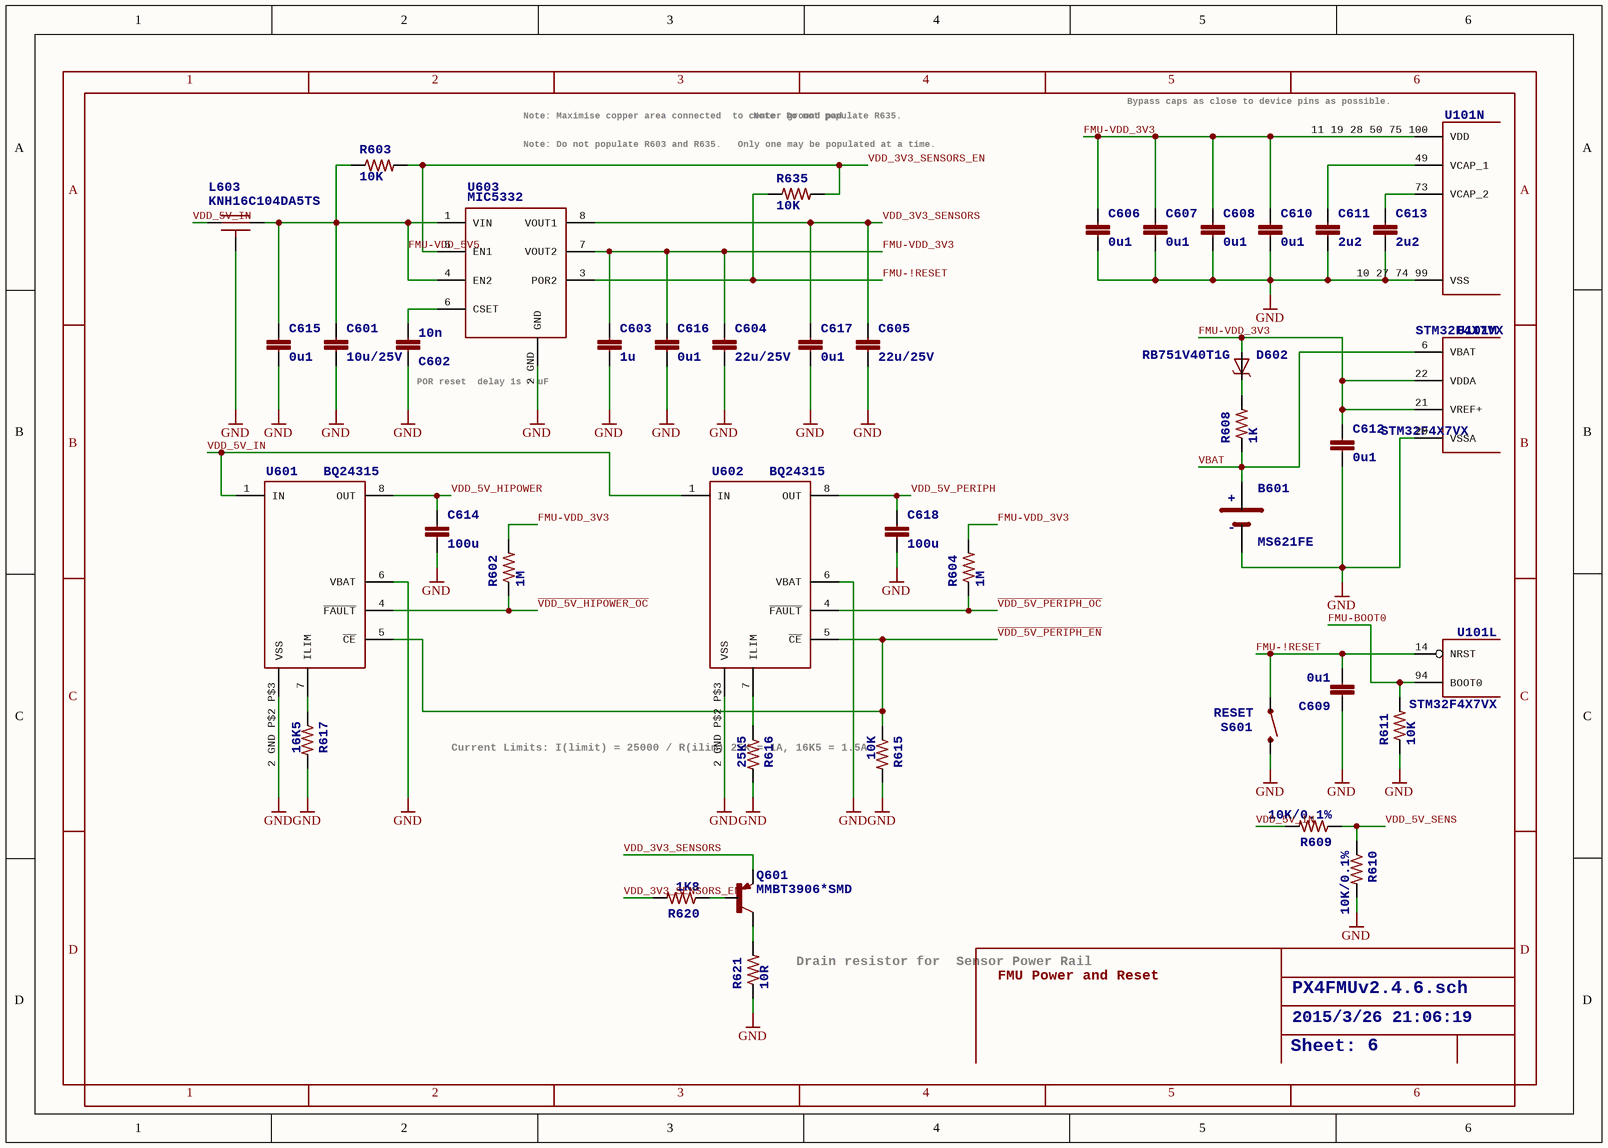
[diagram p5: PX4FMUv2.4.6_06.SchDoc]

### Parts
B601  MS621FE  [MS621FE]
C601  10u/25V  [0805-CAP]
C602  10n  [0402-CAP]
C603  1u  [0603-CAP]
C604  22u/25V  [0805-CAP]
C605  22u/25V  [0805-CAP]
C606  0u1  [0402-CAP]
C607  0u1  [0402-CAP]
C608  0u1  [0402-CAP]
C609  0u1  [0402-CAP]
C610  0u1  [0402-CAP]
C611  2u2  [0603-CAP]
C612  0u1  [0402-CAP]
C613  2u2  [0603-CAP]
C614  100u  [1206-CAP]
C615  0u1  [0402-CAP]
C616  0u1  [0402-CAP]
C617  0u1  [0402-CAP]
C618  100u  [1206-CAP]
D602  RB751V40T1G  [SOD323]
L603  KNH16C104DA5TS  [KYOCERA-KNH16-DA]
Q601  MMBT3906*SMD  [SOT23-BEC]
R602  1M  [0402-RES]
R603  10K  [0402-RES]
R604  1M  [0402-RES]
R608  1K  [0402-RES]
R609  10K/0.1%  [0402-RES]
R610  10K/0.1%  [0402-RES]
R611  10K  [0402-RES]
R615  10K  [0402-RES]
R616  25K5  [0402-RES]
R617  16K5  [0402-RES]
R620  1K8  [0402-RES]
R621  10R  [0603-RES]
R635  10K  [0402-RES]
S601  RESET  [EVQP7J01K]
U101  STM32F4X7VX  [TQFP100]  (parts L,M,N of 14)
U601  BQ24315  [QFN8-DSG]
U602  BQ24315  [QFN8-DSG]
U603  MIC5332  [MLF-8-EPAD]

### Nets
GND: B601.2(NEG) C601.P$2 C602.P$1 C603.P$2 C604.P$2 C605.P$2 C606.P$2 C607.P$2 C608.P$2 C609.P$1 C610.P$2 C611.P$2 C612.P$2 C613.P$2 C614.P$2 C615.P$2 C616.P$2 C617.P$2 C618.P$2 L603.P$3_P$4_P$5(P$3) R610.P$2 R611.P$1 R615.P$2 R616.P$2 R617.P$2 R621.1 S601.B3 U101.10_27_74_99(VSS) U101.20(VSSA) U601.2_GND_P$2_P$3(VSS) U601.6(VBAT) U602.2_GND_P$2_P$3(VSS) U602.6(VBAT) U603.2_GND(GND)
FMU-!RESET: C609.P$2 R635.P$1 S601.A1 U101.14(NRST) U603.3(POR2)
FMU-BOOT0: R611.P$2 U101.94(BOOT0)
FMU-VDD_3V3: C603.P$1 C604.P$1 C606.P$1 C607.P$1 C608.P$1 C610.P$1 C612.P$1 C616.P$1 D602.A R602.P$2 R604.P$2 U101.11_19_28_50_75_100(VDD) U101.21(VREF+) U101.22(VDDA) U603.7(VOUT2)
FMU-VDD_5V5: C601.P$1 C615.P$1 L603.P$2 R603.P$1 U603.1(VIN) U603.4(EN2)
~{VDD_5V_HIPOWER_OC}: R602.P$1 U601.4(~{FAULT})
~{VDD_5V_PERIPH_EN}: R615.P$1 U601.5(~{CE}) U602.5(~{CE})
~{VDD_5V_PERIPH_OC}: R604.P$1 U602.4(~{FAULT})
VBAT: B601.1(POS) R608.P$1 U101.6(VBAT)
VDD_3V3_SENSORS: C605.P$1 C617.P$1 Q601.E U603.8(VOUT1)
VDD_3V3_SENSORS_EN: R603.P$2 R620.P$2 R635.P$2 U603.5(EN1)
VDD_5V_HIPOWER: C614.P$1 U601.8(OUT)
VDD_5V_IN: L603.P$1 R609.P$2 U601.1(IN) U602.1(IN)
VDD_5V_PERIPH: C618.P$1 U602.8(OUT)
VDD_5V_SENS: R609.P$1 R610.P$1
NetC602_P$2: C602.P$2 U603.6(CSET)
NetC611_P$1: C611.P$1 U101.49(VCAP_1)
NetC613_P$1: C613.P$1 U101.73(VCAP_2)
NetD602_C: D602.C R608.P$2
NetQ601_B: Q601.B R620.P$1
NetQ601_C: Q601.C R621.2
NetR616_P$1: R616.P$1 U602.7(ILIM)
NetR617_P$1: R617.P$1 U601.7(ILIM)

### Notes on the sheet
- Note: Maximise copper area connected
  to center ground pad.
- (near R635) Note: Do not populate R603 and R635.
  Only one may be populated at a time.
- Note: Do not populate R635.
- Bypass caps as close to device pins as possible.
- POR reset
  delay 1s / uF
- (near R616) Current Limits:
  I(limit) = 25000 / R(ilim)
  25K = 1A, 16K5 = 1.5A
- Drain resistor for
  Sensor Power Rail
- FMU Power and Reset
- 1
- 2
- 3
- 4
- 5
- 6
- A
- B
- C
- D

### Library data of the parts
B601 = MS621FE: <b>SEIKO 6.8mm Rechargeable 3V lithium battery<b> / <br> / <br> / <b>If discontinued or not available, similar devices are available from Panasonic and Sanyo, usually direct replacements.<b>; PARTNO: MS621FE-FL11E; DATASHEET: http://speed.sii.co.jp/data/file_PRODUCT_MASTER_50112_TITLE_IMAGESP.pdf; LINK: http://search.digikey.com/us/en/products/MS621FE-FL11E/728-1057-ND/1889208; MFGPN: MS621FE; +: +; -: -
C601 = CAP0805: <b>Capacitor</b> / Standard 0603 ceramic capacitor, and 0.1" leaded capacitor.; PARTNO: CL21A106KAYNNNE
C602 = CAP0402: as C504 on sheet PX4FMUv2.4.6_05
C603 = CAP0603: <b>Capacitor</b> / Standard 0603 ceramic capacitor, and 0.1" leaded capacitor.; PARTNO: CC0603ZRY5V7BB105
C604 C605 = CAP0805: <b>Capacitor</b> / Standard 0603 ceramic capacitor, and 0.1" leaded capacitor.; PARTNO: CL21A226MAQNNNE
C606-C610 C612 C615-C617 = CAP0402: as C101 on sheet PX4FMUv2.4.6_01
C611 C613 = CAP0603: as C512 on sheet PX4FMUv2.4.6_05
C614 C618 = CAP1206: <b>Capacitor</b> / Standard 0603 ceramic capacitor, and 0.1" leaded capacitor.; PARTNO: C3216X5R1A107M160AC
D602 = DIODE-SCHOTTKY_SOD323: Schottky barrier diode in DO214AC, e.g. Fairchild SS14.
L603 = KNH16C104DA5TS: Kyocera KNH16C104DA5TS EMI filter; PARTNO: KNH16C104DA5TS
Q601 = MMBT3906*SMD: <b>PNP Transistror</b>
R602 R604 = RESISTOR0402-RES: <b>Resistor</b> / Basic schematic elements and footprints for 0603, 1206, and PTH 1/10th watt (small) resistors.; PARTNO: RC0402FR-071ML
R603 R611 R615 = RESISTOR0402-RES: as R102 on sheet PX4FMUv2.4.6_01
R608 = RESISTOR0402-RES: <b>Resistor</b> / Basic schematic elements and footprints for 0603, 1206, and PTH 1/10th watt (small) resistors.; PARTNO: RC0402FR-071KL
R609 R610 = RESISTOR0402-RES: as R403 on sheet PX4FMUv2.4.6_04
R616 = RESISTOR0402-RES: <b>Resistor</b> / Basic schematic elements and footprints for 0603, 1206, and PTH 1/10th watt (small) resistors.; PARTNO: RMCF0402FT25K5
R617 = RESISTOR0402-RES: <b>Resistor</b> / Basic schematic elements and footprints for 0603, 1206, and PTH 1/10th watt (small) resistors.; PARTNO: RMCF0402FT16K5
R620 = RESISTOR0402-RES: <b>Resistor</b> / Basic schematic elements and footprints for 0603, 1206, and PTH 1/10th watt (small) resistors.; PARTNO: RC1005F182CS
R621 = RESISTOR0603-RES: <b>Resistor</b> / Basic schematic elements and footprints for 0603, 1206, and PTH 1/10th watt (small) resistors.; PARTNO: RC1608J100CS
R635 = RESISTOR0402-RES: <b>Resistor</b> / Basic schematic elements and footprints for 0603, 1206, and PTH 1/10th watt (small) resistors.; PARTNO: RC0402FR-0710KL; BOM: EXCLUDE
S601 = SWITCH-MOMENTARY-2
U101 = STM32F4X7VX: as U101 on sheet PX4FMUv2.4.6_01
U601 U602 = BQ24315: PARTNO: BQ24315DSGR
U603 = MIC5332: PARTNO: MIC5332-SSYMT

## Sheet PX4FMUv2.4.6_07.SchDoc: PX4FMUv2.4.6.sch
size 282 x 200 mm; Date: 2015/3/26 21:06:20; SheetNumber: Sheet:
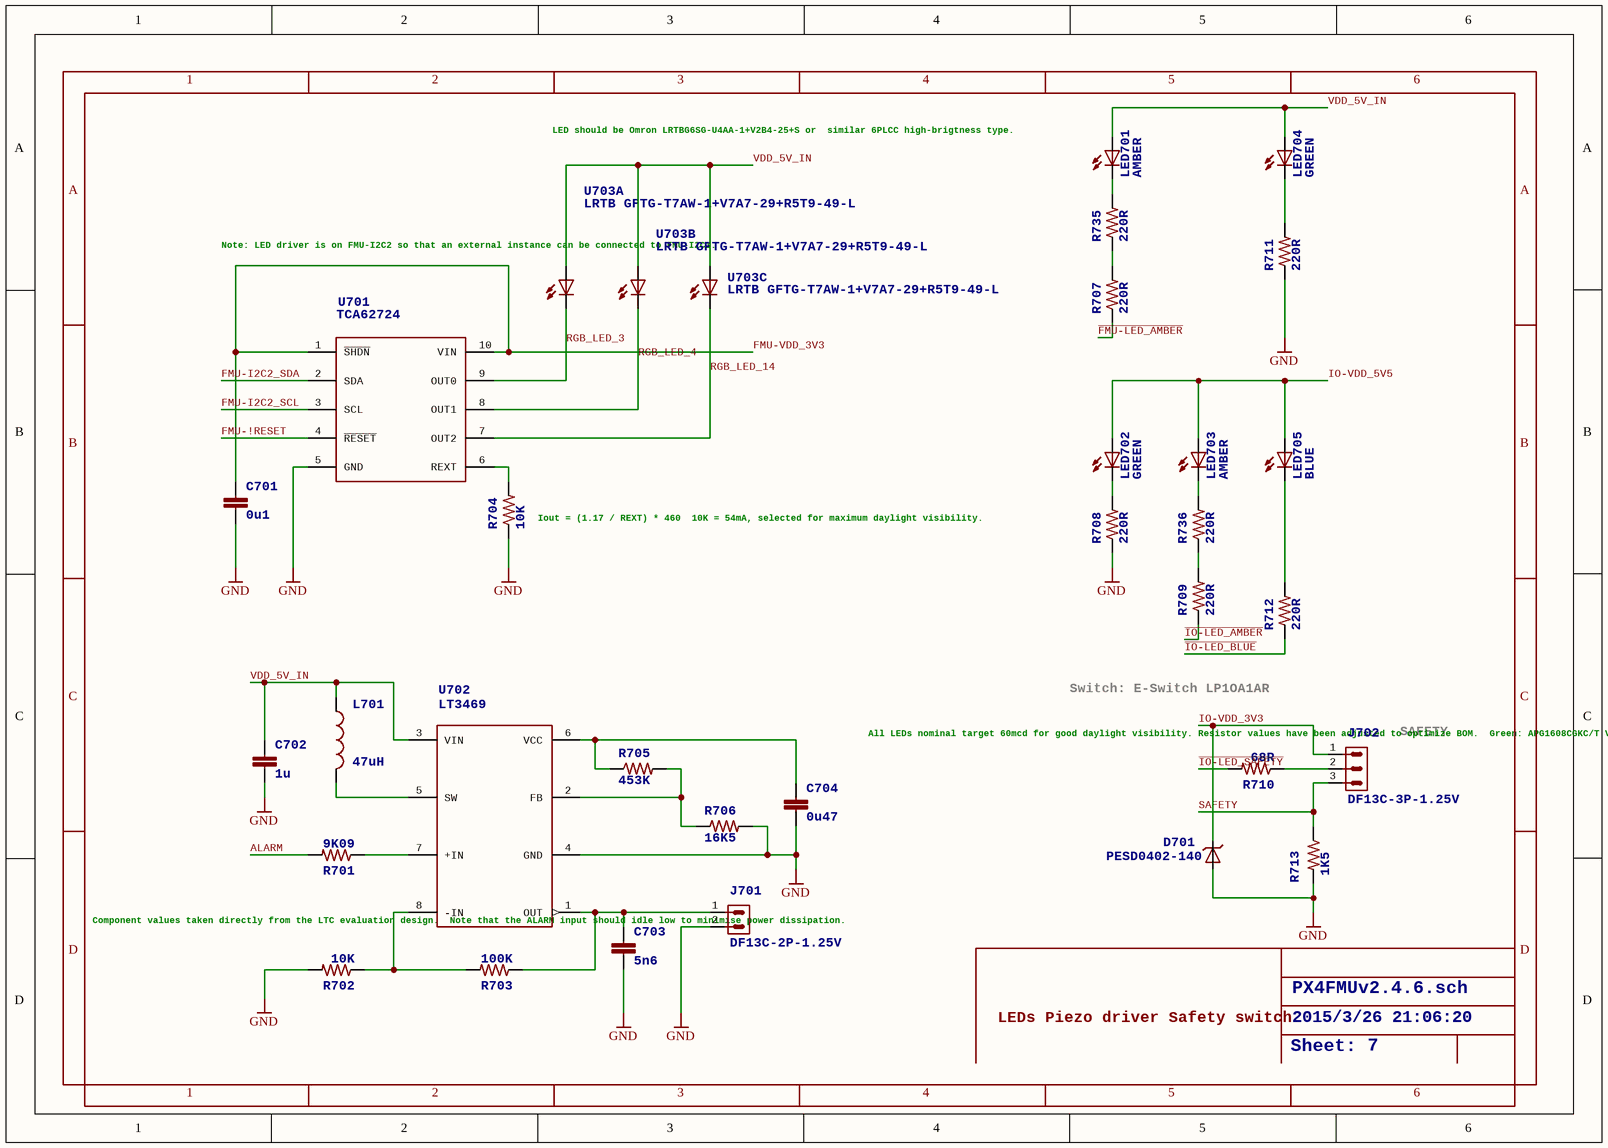
[diagram p6: PX4FMUv2.4.6_07.SchDoc]

### Parts
C701  0u1  [0402-CAP]
C702  1u  [0603-CAP]
C703  5n6  [0402-CAP]
C704  0u47  [0402-CAP]
D701  PESD0402-140  [0402-TVS]
J701  DF13C-2P-1.25V  [DF13C-2P-1.25V]
J702  DF13C-3P-1.25V  [DF13C-3P-1.25V]
L701  47uH  [0805-IND]
LED701  AMBER  [0603-LED]
LED702  GREEN  [0603-LED]
LED703  AMBER  [0603-LED]
LED704  GREEN  [0603-LED]
LED705  BLUE  [0603-LED]
R701  9K09  [0402-RES]
R702  10K  [0402-RES]
R703  100K  [0402-RES]
R704  10K  [0402-RES]
R705  453K  [0402-RES]
R706  16K5  [0402-RES]
R707  220R  [0402-RES]
R708  220R  [0402-RES]
R709  220R  [0402-RES]
R710  68R  [0402-RES]
R711  220R  [0402-RES]
R712  220R  [0402-RES]
R713  1K5  [0402-RES]
R735  220R  [0402-RES]
R736  220R  [0402-RES]
U701  TCA62724FMG  [SON10]  (value not drawn)
U702  LT3469  [SOT23-8]
U703  LRTB GFTG-T7AW-1+V7A7-29+R5T9-49-L  [6-PLCC]  (parts A,B,C of 3)

### Nets
GND: C701.P$2 C702.P$2 C703.P$2 C704.P$2 D701.A J701.2 R702.P$2 R704.P$1 R706.P$2 R708.P$1 R711.P$1 R713.P$2 U701.5(GND) U702.4(GND)
ALARM: R701.P$2
~{FMU-LED_AMBER}: R707.P$1
FMU-!RESET: U701.4(~{RESET})
FMU-I2C2_SCL: U701.3(SCL)
FMU-I2C2_SDA: U701.2(SDA)
FMU-VDD_3V3: C701.P$1 U701.1(~{SHDN}) U701.10(VIN)
~{IO-LED_AMBER}: R709.P$1
~{IO-LED_BLUE}: R712.P$1
~{IO-LED_SAFETY}: R710.P$2
IO-VDD_3V3: D701.C J702.1
IO-VDD_5V5: LED702.A LED703.A LED705.A
RGB_LED_3: U701.9(OUT0) U703.C1(C)
RGB_LED_4: U701.8(OUT1) U703.C2(C)
RGB_LED_14: U701.7(OUT2) U703.C3(C)
SAFETY: J702.3 R713.P$1
VDD_5V_IN: C702.P$1 L701.P$1 LED701.A LED704.A U702.3(VIN) U703.A1(A) U703.A2(A) U703.A3(A)
NetC703_P$1: C703.P$1 J701.1 R703.P$1 U702.1(OUT)
NetC704_P$1: C704.P$1 R705.P$1 U702.6(VCC)
NetJ702_2: J702.2 R710.P$1
NetL701_P$2: L701.P$2 U702.5(SW)
NetLED701_C: LED701.C R735.P$2
NetLED702_C: LED702.C R708.P$2
NetLED703_C: LED703.C R736.P$2
NetLED704_C: LED704.C R711.P$2
NetLED705_C: LED705.C R712.P$2
NetR701_P$1: R701.P$1 U702.7(+IN)
NetR702_P$1: R702.P$1 R703.P$2 U702.8(-IN)
NetR704_P$2: R704.P$2 U701.6(REXT)
NetR705_P$2: R705.P$2 R706.P$1 U702.2(FB)
NetR707_P$2: R707.P$2 R735.P$1
NetR709_P$2: R709.P$2 R736.P$1

### Notes on the sheet
- LED should be Omron LRTBG6SG-U4AA-1+V2B4-25+S or
  similar 6PLCC high-brigtness type.
- (near U703) Note: LED driver is on FMU-I2C2 so
  that an external instance can be
  connected to FMU-I2C1.
- (near R704) Iout = (1.17 / REXT) * 460
  10K = 54mA, selected for maximum
  daylight visibility.
- (near J702) All LEDs nominal target 60mcd
  for good daylight visibility.
  Resistor values have been adjusted
  to optimize BOM.
  Green: APG1608CGKC/T
  Vf(typ): 2.1V
  Target If: 20mA
  Selected R: 220
  Cacluated If @ 5.5V: 15mA
  Amber: APT1608SECK
  Vf(typ): 2.1V
  Target If: 5mA
  Selected R: 440
  Cacluated If @ 5.5V: 8mA
  Blue: APT1608QBC/G
  Vf(typ): 3.3V
  Target If: 6.6mA
  Selected R: 220
  Cacluated If @ 5.5V: 10mA
- Switch: E-Switch LP1OA1AR
- SAFETY
- (near U702) Component values taken directly from
  the LTC evaluation design.
  Note that the ALARM input should idle
  low to minimise power dissipation.
- LEDs
  Piezo driver
  Safety switch
- 1
- 2
- 3
- 4
- 5
- 6
- A
- B
- C
- D

### Library data of the parts
C701 = CAP0402: as C101 on sheet PX4FMUv2.4.6_01
C702 = CAP0603: as C603 on sheet PX4FMUv2.4.6_06
C703 = CAP0402: <b>Capacitor</b> / Standard 0603 ceramic capacitor, and 0.1" leaded capacitor.; PARTNO: C0402C562K5RACTU
C704 = CAP0402: as C510 on sheet PX4FMUv2.4.6_05
D701 = DIODE-TVS
J701 = DF13-2P-1.25V: DF13-2P / 1.25mm Pitch Miniature Crimping Connector.; PARTNO: DF13C-2P-1.25V(20)
J702 = DF13-3P-1.25V: as J402 on sheet PX4FMUv2.4.6_04
L701 = INDUCTOR0805: <b>Inductors</b> / Basic Inductor/Choke - 0603 and 1210. Footprints are not proven and vary greatly between part numbers. / SRR1210: Bourns SRR1210 parts, e.g. SRR1210-100M; PARTNO: MLZ2012M470W
LED701 LED703 = LED0603: <b>LEDs</b> / Standard schematic elements and footprints for 5mm, 3mm, 1206, and 0603 sized LEDs. 5mm - Spark Fun Electronics SKU : COM-00529 (and others); PARTNO: APTD1608SECK
LED702 LED704 = LED0603: <b>LEDs</b> / Standard schematic elements and footprints for 5mm, 3mm, 1206, and 0603 sized LEDs. 5mm - Spark Fun Electronics SKU : COM-00529 (and others); PARTNO: APTD1608CGCK
LED705 = LED0603: <b>LEDs</b> / Standard schematic elements and footprints for 5mm, 3mm, 1206, and 0603 sized LEDs. 5mm - Spark Fun Electronics SKU : COM-00529 (and others); PARTNO: APTD1608QBC/D
R701 = RESISTOR0402-RES: <b>Resistor</b> / Basic schematic elements and footprints for 0603, 1206, and PTH 1/10th watt (small) resistors.; PARTNO: RMCF0402FT9K09
R702 R704 = RESISTOR0402-RES: as R102 on sheet PX4FMUv2.4.6_01
R703 = RESISTOR0402-RES: as R301 on sheet PX4FMUv2.4.6_03
R705 = RESISTOR0402-RES: <b>Resistor</b> / Basic schematic elements and footprints for 0603, 1206, and PTH 1/10th watt (small) resistors.; PARTNO: RMCF0402FT453K
R706 = RESISTOR0402-RES: as R617 on sheet PX4FMUv2.4.6_06
R707-R709 R711 R712 R735 R736 = RESISTOR0402-RES: <b>Resistor</b> / Basic schematic elements and footprints for 0603, 1206, and PTH 1/10th watt (small) resistors.; PARTNO: RC0402FR-07220RL
R710 = RESISTOR0402-RES: <b>Resistor</b> / Basic schematic elements and footprints for 0603, 1206, and PTH 1/10th watt (small) resistors.; PARTNO: ERJ-2GEJ680X
R713 = RESISTOR0402-RES: <b>Resistor</b> / Basic schematic elements and footprints for 0603, 1206, and PTH 1/10th watt (small) resistors.
U701 = TCA62724FMG: Toshiba TCA62724FMG I2C RGB LED driver; PARTNO: TCA62724FMG; TCA62724: TCA62724
U702 = LT3469: LT3469 Piezo microactuator driver with boost regulator; PARTNO: LT3469ETS8
U703 = RGB-LED6-PLCC: RGB LED with separate anode/cathode terminals; PARTNO: LRTB GFTG-T7AW-1+V7A7-29+R5T9-49-L

## Sheet PX4FMUv2.4.6_08.SchDoc: PX4FMUv2.4.6.sch
size 282 x 200 mm; Date: 2015/3/26 21:06:21; SheetNumber: Sheet:
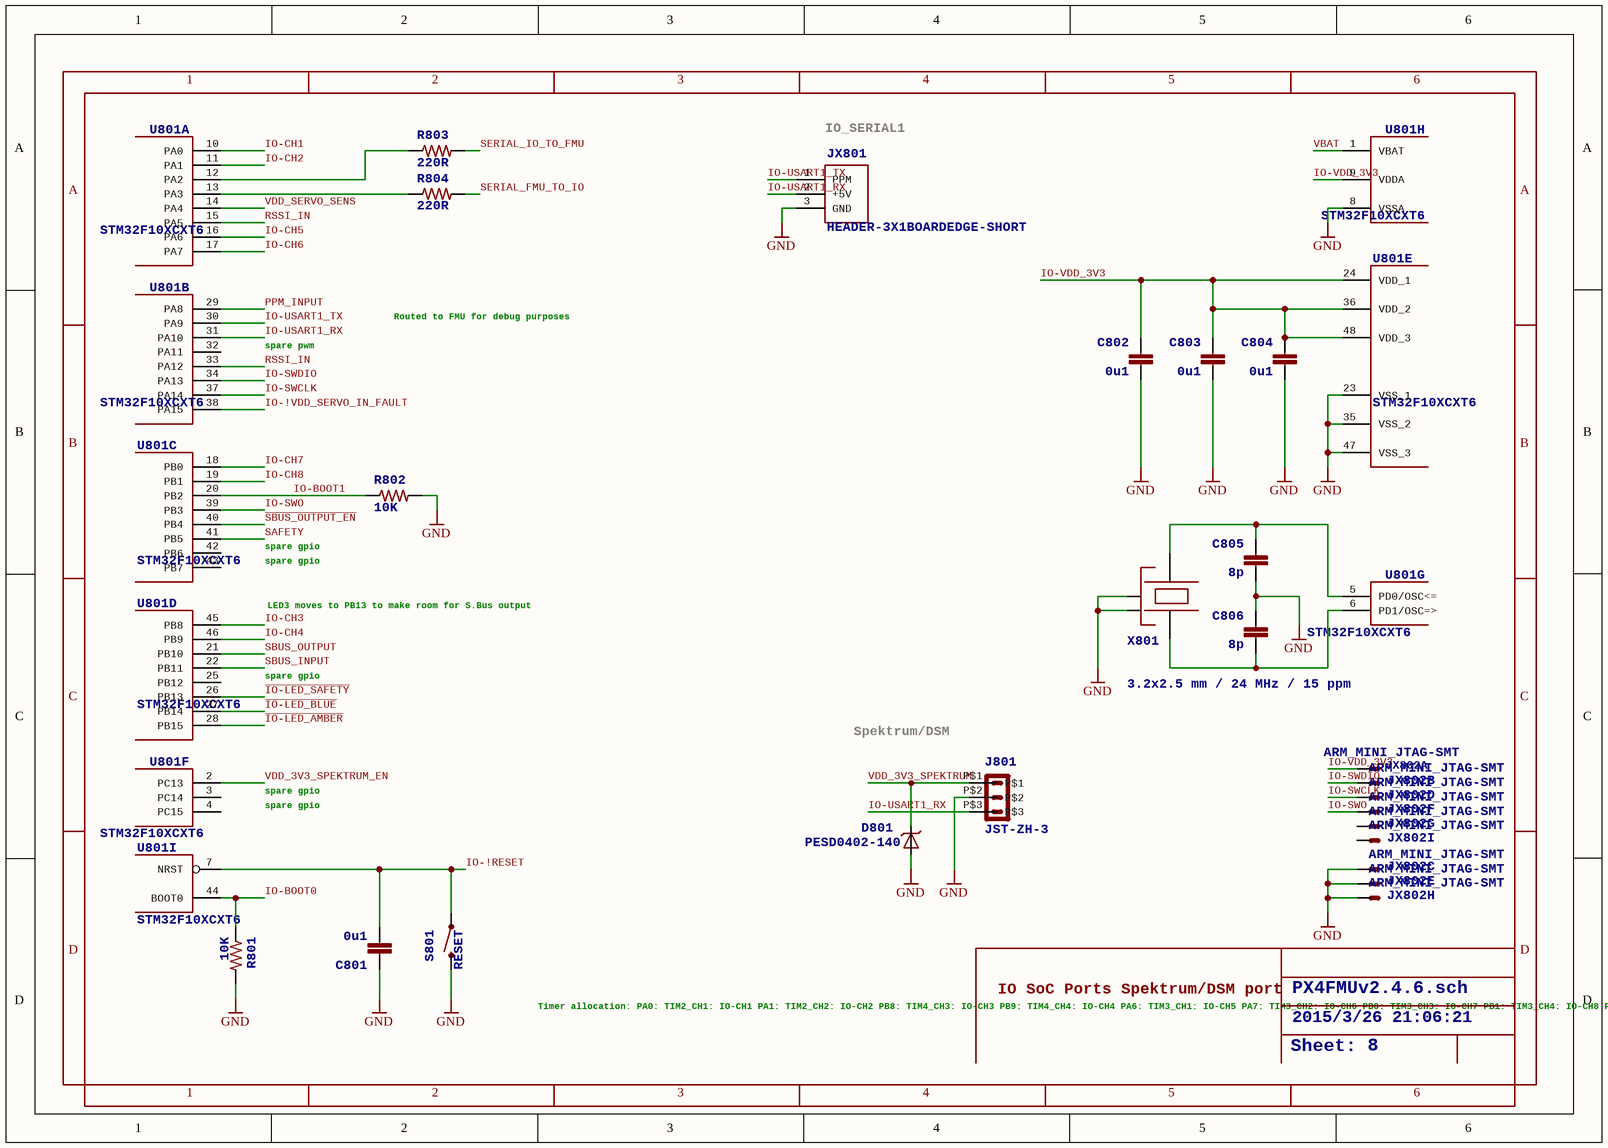
[diagram p7: PX4FMUv2.4.6_08.SchDoc]

### Parts
C801  0u1  [0402-CAP]
C802  0u1  [0402-CAP]
C803  0u1  [0402-CAP]
C804  0u1  [0402-CAP]
C805  8p  [0402-CAP]
C806  8p  [0402-CAP]
D801  PESD0402-140  [0402-TVS]
J801  JST-ZH-3  [JST-ZH-SMT-VERTICAL]
JX801  HEADER-3X1BOARDEDGE-SHORT  [HEADER_3X01_SMD_H_BOARD_EDGE_SHORT]
JX802  ARM_MINI_JTAG-SMT  [FTSH-105-01-XXX-DV-K]  (parts A,B,C,D,E,F,G,H,I of 9)
R801  10K  [0402-RES]
R802  10K  [0402-RES]
R803  220R  [0402-RES]
R804  220R  [0402-RES]
S801  RESET  [EVQP7J01K]
U801  STM32F10XCXT6  [TQFP48]  (parts A,B,C,D,E,F,G,H,I of 9)
X801  3.2x2.5 mm / 24 MHz / 15 ppm  [OSCILLATOR-3.2X2.5]

### Nets
GND: C801.P$1 C802.P$2 C803.P$2 C804.P$2 C805.P$2 C806.P$1 D801.A J801.P$2 JX801.3(GND) JX802.3(S) JX802.5(S) JX802.9(S) R801.P$2 R802.P$2 S801.B3 U801.8(VSSA) U801.23(VSS_1) U801.35(VSS_2) U801.47(VSS_3) X801.2(NC_2) X801.4(NC_4)
~{IO-LED_AMBER}: U801.28(PB15)
~{IO-LED_BLUE}: U801.27(PB14)
~{IO-LED_SAFETY}: U801.26(PB13)
IO-!RESET: C801.P$2 S801.A1 U801.7(NRST)
IO-!VDD_SERVO_IN_FAULT: U801.38(PA15)
IO-BOOT0: R801.P$1 U801.44(BOOT0)
IO-BOOT1: R802.P$1 U801.20(PB2)
IO-CH1: U801.10(PA0)
IO-CH2: U801.11(PA1)
IO-CH3: U801.45(PB8)
IO-CH4: U801.46(PB9)
IO-CH5: U801.16(PA6)
IO-CH6: U801.17(PA7)
IO-CH7: U801.18(PB0)
IO-CH8: U801.19(PB1)
IO-SWCLK: JX802.4(S) U801.37(PA14)
IO-SWDIO: JX802.2(S) U801.34(PA13)
IO-SWO: JX802.6(S) U801.39(PB3)
IO-USART1_RX: J801.P$3 JX801.2(+5V) U801.31(PA10)
IO-USART1_TX: JX801.1(PPM) U801.30(PA9)
IO-VDD_3V3: C802.P$1 C803.P$1 C804.P$1 JX802.1(S) U801.9(VDDA) U801.24(VDD_1) U801.36(VDD_2) U801.48(VDD_3)
PPM_INPUT: U801.29(PA8)
RSSI_IN: U801.15(PA5) U801.33(PA12)
~{SBUS_OUTPUT_EN}: U801.40(PB4)
SAFETY: U801.41(PB5)
SBUS_INPUT: U801.22(PB11)
SBUS_OUTPUT: U801.21(PB10)
SERIAL_FMU_TO_IO: R804.P$2
SERIAL_IO_TO_FMU: R803.P$2
VBAT: U801.1(VBAT)
VDD_3V3_SPEKTRUM: D801.C J801.P$1
VDD_3V3_SPEKTRUM_EN: U801.2(PC13)
VDD_SERVO_SENS: U801.14(PA4)
NetC805_P$1: C805.P$1 U801.5(PD0/OSC<=) X801.3
NetC806_P$2: C806.P$2 U801.6(PD1/OSC=>) X801.1
NetR803_P$1: R803.P$1 U801.12(PA2)
NetR804_P$1: R804.P$1 U801.13(PA3)

Not connected (* = marked no-connect by the designer): JX802 8(S) 10(S); U801 3(PC14) 4(PC15) 25(PB12) 32(PA11) 42(PB6) 43(PB7)

### Notes on the sheet
- (near JX801) IO_SERIAL1
- spare pwm
- Routed to FMU for debug purposes
- spare gpio
- LED3 moves to PB13 to make room for S.Bus output
- Spektrum/DSM
- Timer allocation:
  PA0: TIM2_CH1: IO-CH1
  PA1: TIM2_CH2: IO-CH2
  PB8: TIM4_CH3: IO-CH3
  PB9: TIM4_CH4: IO-CH4
  PA6: TIM3_CH1: IO-CH5
  PA7: TIM3_CH2: IO-CH6
  PB0: TIM3_CH3: IO-CH7
  PB1: TIM3_CH4: IO-CH8
  PA8: TIM1_CH1: PPM_IN
  PA11: TIM1_CH4: RSSI_IN
- IO SoC Ports
  Spektrum/DSM port
- 1
- 2
- 3
- 4
- 5
- 6
- A
- B
- C
- D

### Library data of the parts
C801-C804 = CAP0402: as C101 on sheet PX4FMUv2.4.6_01
C805 C806 = CAP0402: as C102 on sheet PX4FMUv2.4.6_01
D801 = DIODE-TVS
J801 = JST-ZH-3: PARTNO: B3B-ZR-SM4-TF (LF)(SN)(P)
JX801 = HEADER-3X1BOARDEDGE-SHORT: <h3>Single row 0.1" servo header</h3>; BOM: EXCLUDE
JX802 = ARM_MINI_JTAG-SMT: as JX301 on sheet PX4FMUv2.4.6_03
R801 R802 = RESISTOR0402-RES: as R102 on sheet PX4FMUv2.4.6_01
R803 R804 = RESISTOR0402-RES: as R707 on sheet PX4FMUv2.4.6_07
S801 = SWITCH-MOMENTARY-2: PARTNO: EVQ-P7J01P
U801 = STM32F10XCXT6: ST STM32F101/103 48pin LQFP; PARTNO: STM32F100C8T6B
X801 = OSCILLATOR-3.2X2.5: Crystal Oscillator in 3.2x2.5 SMD

## Sheet PX4FMUv2.4.6_09.SchDoc: PX4FMUv2.4.6.sch
size 282 x 200 mm; Date: 2015/3/26 21:06:22; SheetNumber: Sheet:
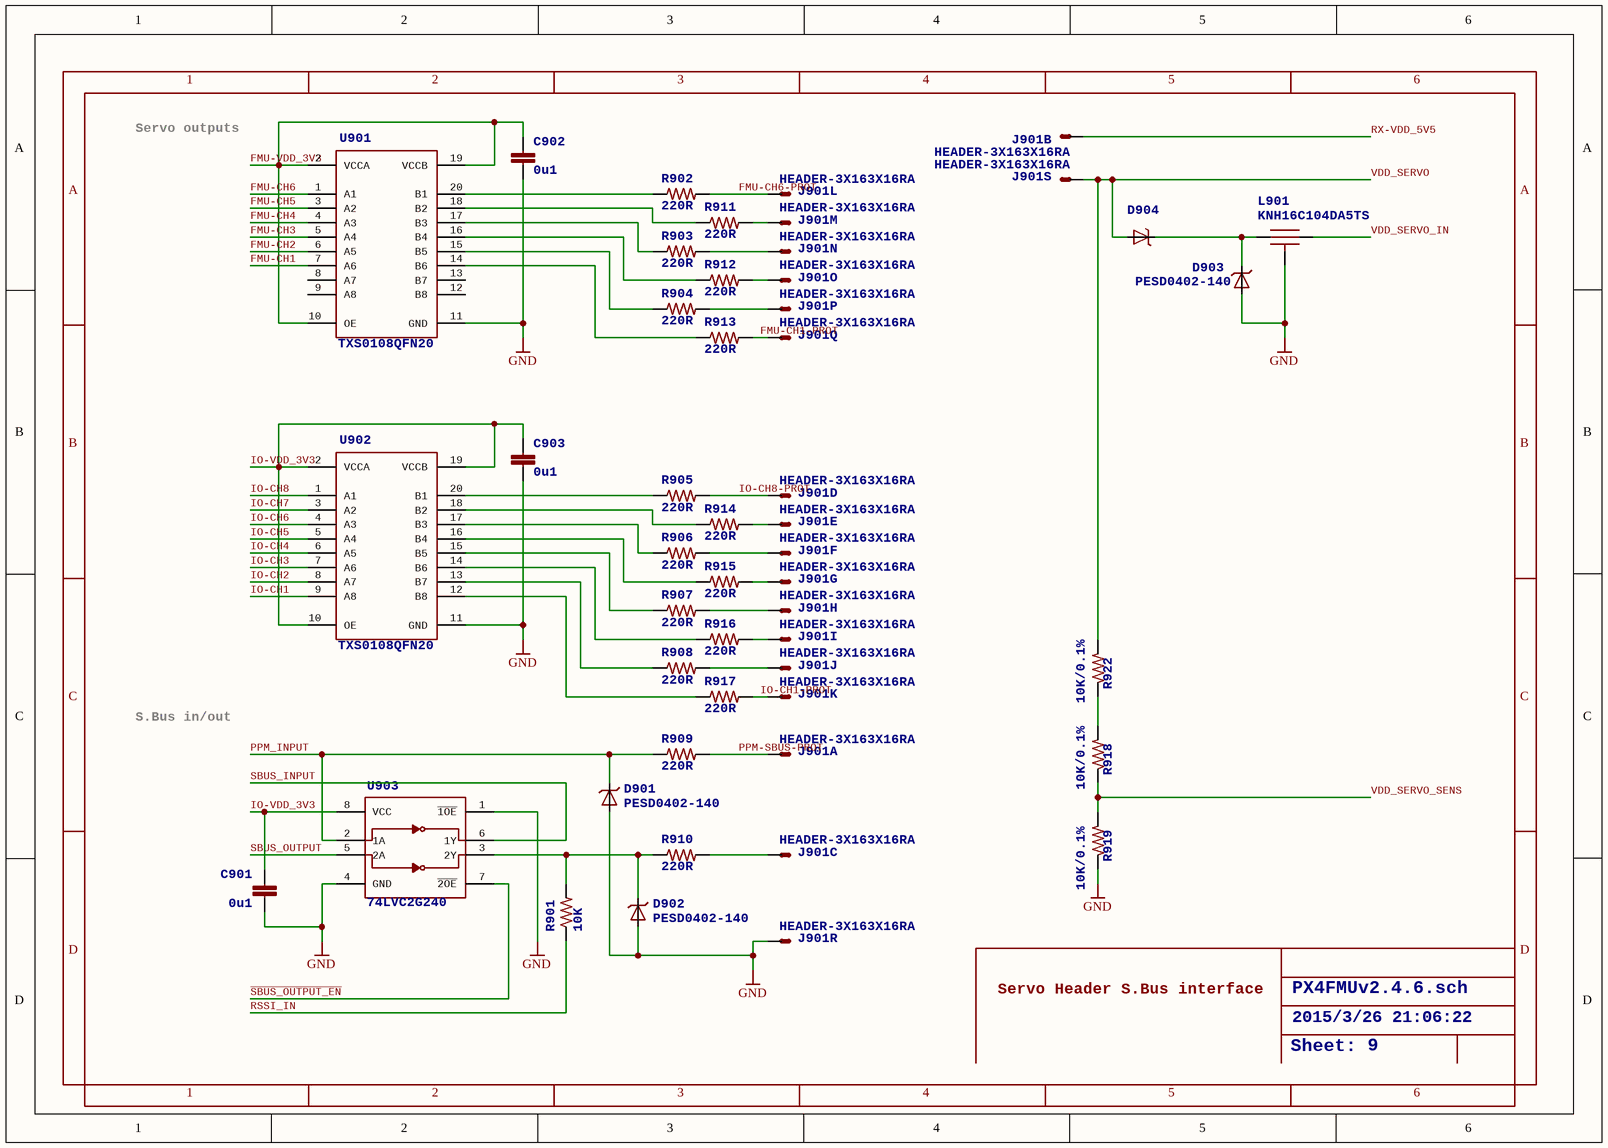
[diagram p8: PX4FMUv2.4.6_09.SchDoc]

### Parts
C901  0u1  [0402-CAP]
C902  0u1  [0402-CAP]
C903  0u1  [0402-CAP]
D901  PESD0402-140  [0402-TVS]
D902  PESD0402-140  [0402-TVS]
D903  PESD0402-140  [0402-TVS]
D904  MSS1P4-M3  [MICROSMP]  (value not drawn)
J901  HEADER-3X163X16RA  [3X16RA]  (parts A,B,C,D,E,F,G,H,I,J,K,L,M,N,O,P,Q,R,S of 19)
L901  KNH16C104DA5TS  [KYOCERA-KNH16-DA]
R901  10K  [0402-RES]
R902  220R  [0402-RES]
R903  220R  [0402-RES]
R904  220R  [0402-RES]
R905  220R  [0402-RES]
R906  220R  [0402-RES]
R907  220R  [0402-RES]
R908  220R  [0402-RES]
R909  220R  [0402-RES]
R910  220R  [0402-RES]
R911  220R  [0402-RES]
R912  220R  [0402-RES]
R913  220R  [0402-RES]
R914  220R  [0402-RES]
R915  220R  [0402-RES]
R916  220R  [0402-RES]
R917  220R  [0402-RES]
R918  10K/0.1%  [0402-RES]
R919  10K/0.1%  [0402-RES]
R922  10K/0.1%  [0402-RES]
U901  TXS0108QFN20  [QFN20-RGY]
U902  TXS0108QFN20  [QFN20-RGY]
U903  74LVC2G240  [TSSOP8_SOT505-2]

### Nets
GND: C901.P$2 C902.P$2 C903.P$2 D901.A D902.A D903.A J901.3_6_9_12_15_18_21_24_27_30_33_36_39_42_45_48(S) L901.P$3_P$4_P$5(P$3) R919.P$1 U901.11(GND) U902.11(GND) U903.1(~{1OE}) U903.4(GND)
FMU-CH1: U901.7(A6)
FMU-CH1-PROT: J901.46(S) R913.P$2
FMU-CH2: U901.6(A5)
FMU-CH3: U901.5(A4)
FMU-CH4: U901.4(A3)
FMU-CH5: U901.3(A2)
FMU-CH6: U901.1(A1)
FMU-CH6-PROT: J901.31(S) R902.P$2
FMU-VDD_3V3: C902.P$1 U901.2(VCCA) U901.10(OE) U901.19(VCCB)
IO-CH1: U902.9(A8)
IO-CH1-PROT: J901.28(S) R917.P$2
IO-CH2: U902.8(A7)
IO-CH3: U902.7(A6)
IO-CH4: U902.6(A5)
IO-CH5: U902.5(A4)
IO-CH6: U902.4(A3)
IO-CH7: U902.3(A2)
IO-CH8: U902.1(A1)
IO-CH8-PROT: J901.7(S) R905.P$2
IO-VDD_3V3: C901.P$1 C903.P$1 U902.2(VCCA) U902.10(OE) U902.19(VCCB) U903.8(VCC)
PPM-SBUS-PROT: J901.1(S) R909.P$2
PPM_INPUT: D901.C R909.P$1 U903.2(1A)
RSSI_IN: R901.P$1
RX-VDD_5V5: J901.2(S)
~{SBUS_OUTPUT_EN}: U903.7(~{2OE})
SBUS_INPUT: U903.6(1Y)
SBUS_OUTPUT: U903.5(2A)
VDD_SERVO: D904.ANODE(A) J901.5_8_11_14_17_20_23_26_29_32_35_38_41_44_47(S) R922.P$2
VDD_SERVO_IN: L901.P$2
VDD_SERVO_SENS: R918.P$1 R919.P$2
NetD902_C: D902.C R901.P$2 R910.P$1 U903.3(2Y)
NetD903_C: D903.C D904.CATHODE(C) L901.P$1
NetJ901_4: J901.4(S) R910.P$2
NetJ901_10: J901.10(S) R914.P$2
NetJ901_13: J901.13(S) R906.P$2
NetJ901_16: J901.16(S) R915.P$2
NetJ901_19: J901.19(S) R907.P$2
NetJ901_22: J901.22(S) R916.P$2
NetJ901_25: J901.25(S) R908.P$2
NetJ901_34: J901.34(S) R911.P$2
NetJ901_37: J901.37(S) R903.P$2
NetJ901_40: J901.40(S) R912.P$2
NetJ901_43: J901.43(S) R904.P$2
NetR902_P$1: R902.P$1 U901.20(B1)
NetR903_P$1: R903.P$1 U901.17(B3)
NetR904_P$1: R904.P$1 U901.15(B5)
NetR905_P$1: R905.P$1 U902.20(B1)
NetR906_P$1: R906.P$1 U902.17(B3)
NetR907_P$1: R907.P$1 U902.15(B5)
NetR908_P$1: R908.P$1 U902.13(B7)
NetR911_P$1: R911.P$1 U901.18(B2)
NetR912_P$1: R912.P$1 U901.16(B4)
NetR913_P$1: R913.P$1 U901.14(B6)
NetR914_P$1: R914.P$1 U902.18(B2)
NetR915_P$1: R915.P$1 U902.16(B4)
NetR916_P$1: R916.P$1 U902.14(B6)
NetR917_P$1: R917.P$1 U902.12(B8)
NetR918_P$2: R918.P$2 R922.P$1

Not connected (* = marked no-connect by the designer): U901 8(A7) 9(A8) 12(B8) 13(B7)

### Notes on the sheet
- Servo outputs
- S.Bus in/out
- Servo Header
  S.Bus interface
- 1
- 2
- 3
- 4
- 5
- 6
- A
- B
- C
- D

### Library data of the parts
C901-C903 = CAP0402: as C101 on sheet PX4FMUv2.4.6_01
D901-D903 = DIODE-TVS
D904 = DIODE-SCHOTTKY_MSMP: Schottky barrier diode in DO214AC, e.g. Fairchild SS14.
J901 = HEADER-3X163X16RA: 3x16 servo header; BOM: EXCLUDE
L901 = KNH16C104DA5TS: Kyocera KNH16C104DA5TS EMI filter; PARTNO: KNH16C104DA5TS
R901 = RESISTOR0402-RES: as R102 on sheet PX4FMUv2.4.6_01
R902-R917 = RESISTOR0402-RES: as R707 on sheet PX4FMUv2.4.6_07
R918 R919 R922 = RESISTOR0402-RES: as R713 on sheet PX4FMUv2.4.6_07
U901 U902 = TXS0108QFN20: PARTNO: TXS0108ERGYR
U903 = 74LVC2G240-TSSOP-8: Dual inverter tri-state, 3.3V/5V compatible / <br /> / <a href="http://www.nxp.com/documents/data_sheet/74LVC2G240.pdf">http://www.nxp.com/documents/data_sheet/74LVC2G240.pdf</a><br /> / <a href="http://focus.ti.com/lit/ds/symlink/sn74lvc2g240.pdf">http://focus.ti.com/lit/ds/symlink/sn74lvc2g240.pdf</a>; PARTNO: 74LVC2G240DP,125

## Sheet PX4FMUv2.4.6_10.SchDoc: PX4FMUv2.4.6.sch
size 282 x 200 mm; Date: 2015/3/26 21:06:23; SheetNumber: Sheet:
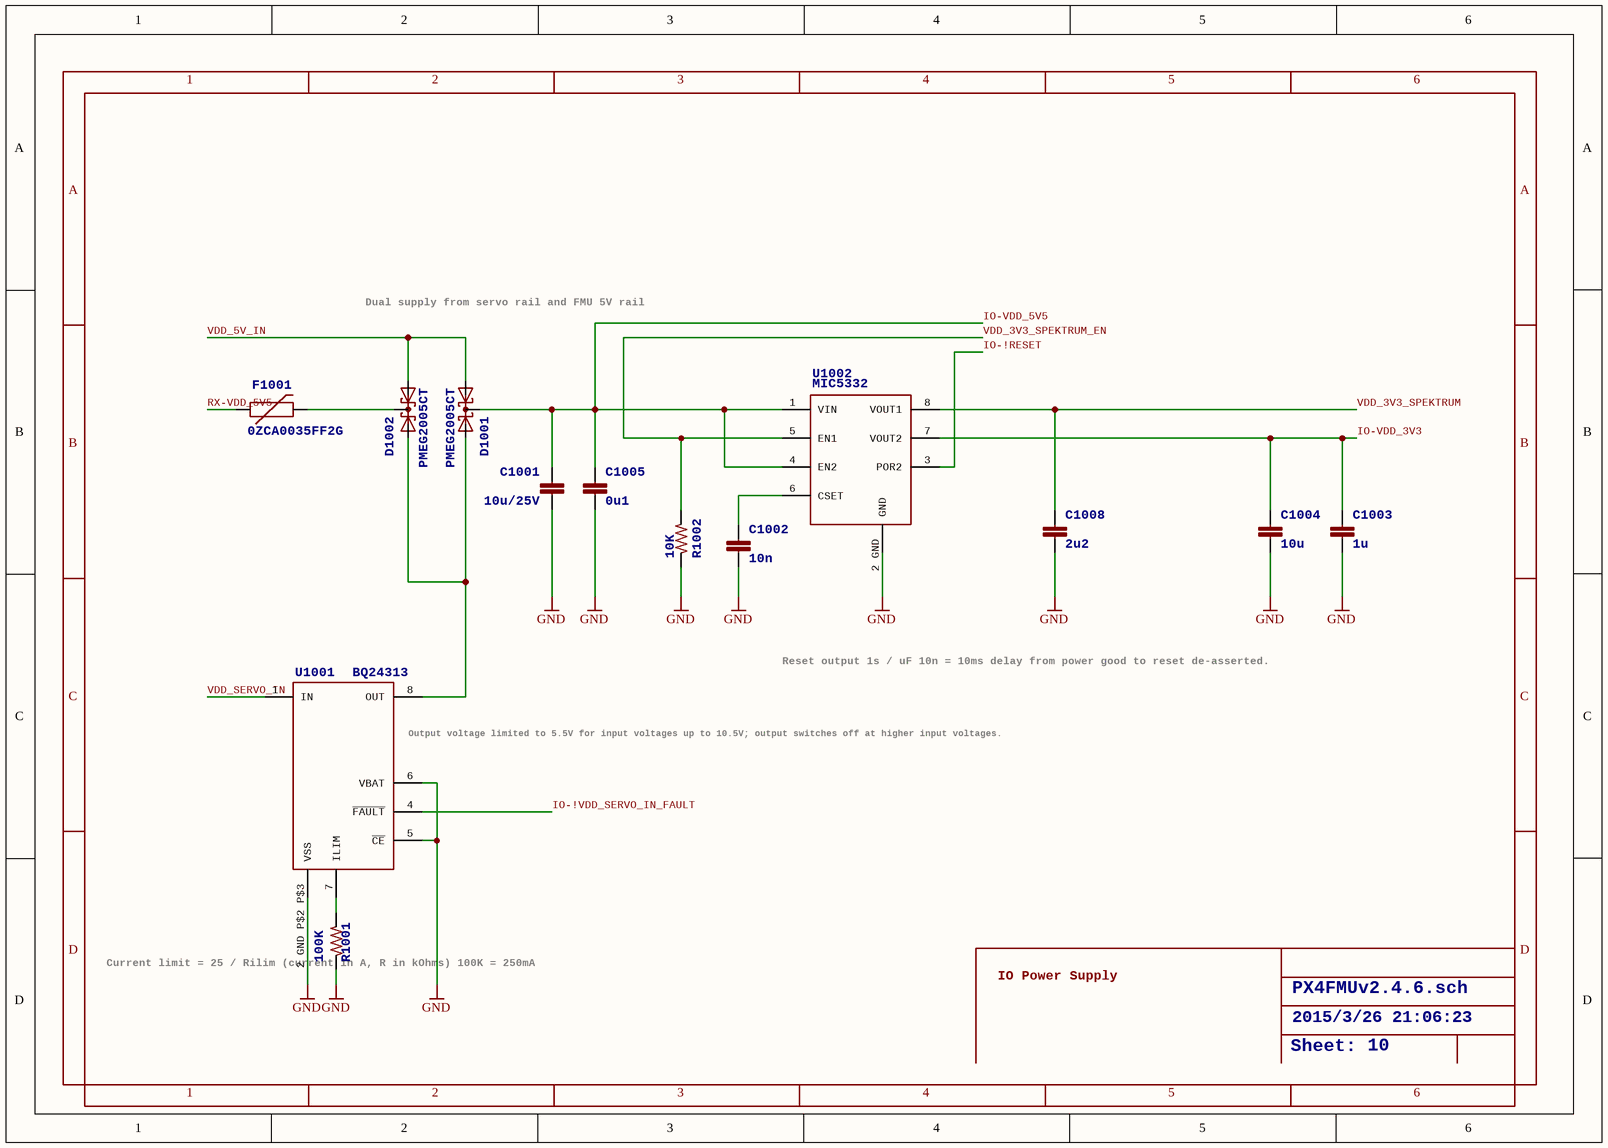
[diagram p9: PX4FMUv2.4.6_10.SchDoc]

### Parts
C1001  10u/25V  [0805-CAP]
C1002  10n  [0402-CAP]
C1003  1u  [0603-CAP]
C1004  10u  [0603-CAP]
C1005  0u1  [0402-CAP]
C1008  2u2  [0402-CAP]
D1001  PMEG2005CT  [SOT23-3]
D1002  PMEG2005CT  [SOT23-3]
F1001  0ZCA0035FF2G  [PTC-1206]
R1001  100K  [0402-RES]
R1002  10K  [0402-RES]
U1001  BQ24313  [QFN8-DSG]
U1002  MIC5332  [MLF-8-EPAD]

### Nets
GND: C1001.P$2 C1002.P$2 C1003.P$2 C1004.P$2 C1005.P$2 C1008.P$2 R1001.P$1 R1002.P$1 U1001.2_GND_P$2_P$3(VSS) U1001.5(~{CE}) U1001.6(VBAT) U1002.2_GND(GND)
IO-!RESET: U1002.3(POR2)
IO-!VDD_SERVO_IN_FAULT: U1001.4(~{FAULT})
IO-VDD_3V3: C1003.P$1 C1004.P$1 U1002.7(VOUT2)
IO-VDD_5V5: C1001.P$1 C1005.P$1 D1001.3(CC) U1002.1(VIN) U1002.4(EN2)
RX-VDD_5V5: F1001.1
VDD_3V3_SPEKTRUM: C1008.P$1 U1002.8(VOUT1)
VDD_3V3_SPEKTRUM_EN: R1002.P$2 U1002.5(EN1)
VDD_5V_IN: D1001.1(A1) D1002.1(A1)
VDD_SERVO_IN: U1001.1(IN)
NetC1002_P$1: C1002.P$1 U1002.6(CSET)
NetD1001_2: D1001.2(A2) D1002.2(A2) U1001.8(OUT)
NetD1002_3: D1002.3(CC) F1001.2
NetR1001_P$2: R1001.P$2 U1001.7(ILIM)

### Notes on the sheet
- Dual supply from
  servo rail and FMU 5V rail
- Reset output 1s / uF
  10n = 10ms delay from power good
  to reset de-asserted.
- (near U1001) Output voltage limited to 5.5V for
  input voltages up to 10.5V; output
  switches off at higher input voltages.
- (near R1001) Current limit = 25 / Rilim
  (current in A, R in kOhms)
  100K = 250mA
- IO Power Supply
- 1
- 2
- 3
- 4
- 5
- 6
- A
- B
- C
- D

### Library data of the parts
C1001 = CAP0805: as C601 on sheet PX4FMUv2.4.6_06
C1002 = CAP0402: as C504 on sheet PX4FMUv2.4.6_05
C1003 = CAP0603: as C603 on sheet PX4FMUv2.4.6_06
C1004 = CAP0603: <b>Capacitor</b> / Standard 0603 ceramic capacitor, and 0.1" leaded capacitor.; PARTNO: C1608X5R1A106K080AC
C1005 = CAP0402: as C101 on sheet PX4FMUv2.4.6_01
C1008 = CAP0402: <b>Capacitor</b> / Standard 0603 ceramic capacitor, and 0.1" leaded capacitor.; PARTNO: C1005X6S1C225K050BC
D1001 D1002 = PMEG2005CT: <b>500 mA low VF dual MEGA Schottky barrier rectifier</b> / <p>http://www.nxp.com/documents/data_sheet/PMEG2005CT.pdf</p>; PARTNO: PMEG2005CT
F1001 = PTCSMD: <b>Resettable Fuse PTC</b> / Resettable Fuse. Spark Fun Electronics SKU : COM-08357; PARTNO: 0ZCA0035FF2G
R1001 = RESISTOR0402-RES: as R713 on sheet PX4FMUv2.4.6_07
R1002 = RESISTOR0402-RES: as R102 on sheet PX4FMUv2.4.6_01
U1001 = BQ24313: PARTNO: BQ24313DSGT
U1002 = MIC5332: PARTNO: MIC5332-SSYMT

## Sheet PX4FMUv2.4.6_11.SchDoc: PX4FMUv2.4.6.sch
size 282 x 200 mm; Date: 2015/3/26 21:06:24; SheetNumber: Sheet:
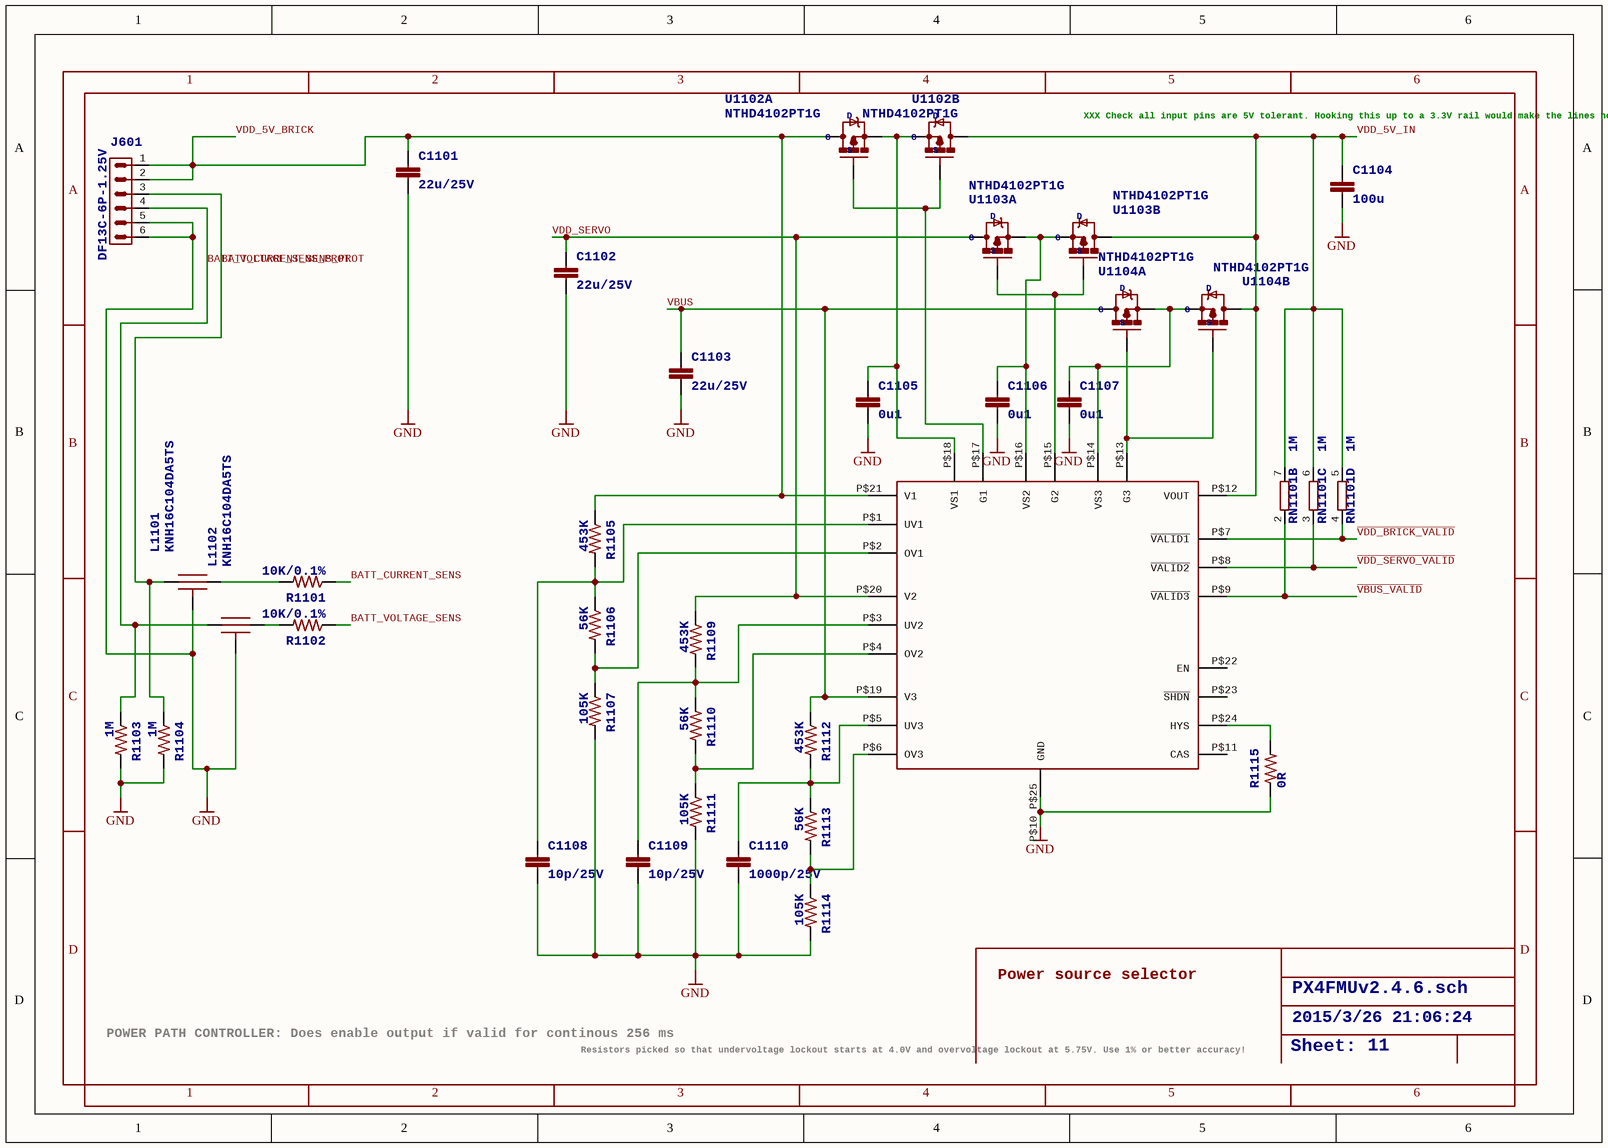
[diagram p10: PX4FMUv2.4.6_11.SchDoc]

### Parts
C1101  22u/25V  [0805-CAP]
C1102  22u/25V  [0805-CAP]
C1103  22u/25V  [0805-CAP]
C1104  100u  [1206-CAP]
C1105  0u1  [0402-CAP]
C1106  0u1  [0402-CAP]
C1107  0u1  [0402-CAP]
C1108  10p/25V  [0402-CAP]
C1109  10p/25V  [0402-CAP]
C1110  1000p/25V  [0402-CAP]
J601  DF13C-6P-1.25V  [DF13C-6P-1.25V]
L1101  KNH16C104DA5TS  [KYOCERA-KNH16-DA]
L1102  KNH16C104DA5TS  [KYOCERA-KNH16-DA]
R1101  10K/0.1%  [0402-RES]
R1102  10K/0.1%  [0402-RES]
R1103  1M  [0402-RES]
R1104  1M  [0402-RES]
R1105  453K  [0402-RES]
R1106  56K  [0402-RES]
R1107  105K  [0402-RES]
R1109  453K  [0402-RES]
R1110  56K  [0402-RES]
R1111  105K  [0402-RES]
R1112  453K  [0402-RES]
R1113  56K  [0402-RES]
R1114  105K  [0402-RES]
R1115  0R  [0402-RES]
RN1101  1M  [EXB28V]  (parts B,C,D of 4)
U1101  LTC4417  [MO-220]  (value not drawn)
U1102  NTHD4102PT1G  [1206-8]  (parts A,B of 2)
U1103  NTHD4102PT1G  [1206-8]  (parts A,B of 2)
U1104  NTHD4102PT1G  [1206-8]  (parts A,B of 2)

### Nets
GND: C1101.P$2 C1102.P$2 C1103.P$2 C1104.P$2 C1105.P$2 C1106.P$2 C1107.P$2 C1108.P$2 C1109.P$2 C1110.P$2 J601.5 J601.6 L1101.P$3_P$4_P$5(P$3) L1102.P$3_P$4_P$5(P$3) R1103.P$2 R1104.P$2 R1107.P$2 R1111.P$2 R1114.P$2 R1115.P$1 U1101.P$10_P$25(GND)
BATT_CURRENT_SENS: R1101.P$1
BATT_CURRENT_SENS_PROT: J601.3 L1101.P$1 R1104.P$1
BATT_VOLTAGE_SENS: R1102.P$1
BATT_VOLTAGE_SENS_PROT: J601.4 L1102.P$1 R1103.P$1
~{VBUS_VALID}: RN1101.2 U1101.P$9(~{VALID3})
~{VDD_BRICK_VALID}: RN1101.4 U1101.P$7(~{VALID1})
~{VDD_SERVO_VALID}: RN1101.3 U1101.P$8(~{VALID2})
VBUS: C1103.P$1 R1112.P$1 U1101.P$19(V3) U1104.P$7_P$8(D)
VDD_5V_BRICK: C1101.P$1 J601.1 J601.2 R1105.P$1 U1101.P$21(V1) U1102.P$7_P$8(D)
VDD_5V_IN: C1104.P$1 RN1101.5 RN1101.6 RN1101.7 U1101.P$12(VOUT) U1102.P$5_P$6(D) U1103.P$5_P$6(D) U1104.P$5_P$6(D)
VDD_SERVO: C1102.P$1 R1109.P$1 U1101.P$20(V2) U1103.P$7_P$8(D)
NetC1105_P$1: C1105.P$1 U1101.P$18(VS1) U1102.P$1(S) U1102.P$3(S)
NetC1106_P$1: C1106.P$1 U1101.P$16(VS2) U1103.P$1(S) U1103.P$3(S)
NetC1107_P$1: C1107.P$1 U1101.P$14(VS3) U1104.P$1(S) U1104.P$3(S)
NetC1108_P$1: C1108.P$1 R1105.P$2 R1106.P$1 U1101.P$1(UV1)
NetC1109_P$1: C1109.P$1 R1109.P$2 R1110.P$1 U1101.P$3(UV2)
NetC1110_P$1: C1110.P$1 R1112.P$2 R1113.P$1 U1101.P$5(UV3)
NetL1101_P$2: L1101.P$2 R1101.P$2
NetL1102_P$2: L1102.P$2 R1102.P$2
NetR1106_P$2: R1106.P$2 R1107.P$1 U1101.P$2(OV1)
NetR1110_P$2: R1110.P$2 R1111.P$1 U1101.P$4(OV2)
NetR1113_P$2: R1113.P$2 R1114.P$1 U1101.P$6(OV3)
NetR1115_P$2: R1115.P$2 U1101.P$24(HYS)
NetU1101_P$13: U1101.P$13(G3) U1104.P$2(G) U1104.P$4(G)
NetU1101_P$15: U1101.P$15(G2) U1103.P$2(G) U1103.P$4(G)
NetU1101_P$17: U1101.P$17(G1) U1102.P$2(G) U1102.P$4(G)

Not connected (* = marked no-connect by the designer): U1101 P$11(CAS) P$22(EN) P$23(~{SHDN})

### Notes on the sheet
- XXX Check all input pins are 5V tolerant.
  Hooking this up to a 3.3V rail
  would make the lines non-readable during power-up sequencing
- Power source selector
- POWER PATH CONTROLLER:
  Does enable output if valid for continous 256 ms
- Resistors picked so that undervoltage lockout starts at 4.0V
  and overvoltage lockout at 5.75V.
  Use 1% or better accuracy!
- 1
- 2
- 3
- 4
- 5
- 6
- A
- B
- C
- D

### Library data of the parts
C1101-C1103 = CAP0805: as C604 on sheet PX4FMUv2.4.6_06
C1104 = CAP1206: as C614 on sheet PX4FMUv2.4.6_06
C1105-C1107 = CAP0402: <b>Capacitor</b> / Standard 0603 ceramic capacitor, and 0.1" leaded capacitor.; PARTNO: C1005X7R1E104K050BB
C1108 C1109 = CAP0402: <b>Capacitor</b> / Standard 0603 ceramic capacitor, and 0.1" leaded capacitor.; PARTNO: C0402C100J3GACTU
C1110 = CAP0402: <b>Capacitor</b> / Standard 0603 ceramic capacitor, and 0.1" leaded capacitor.; PARTNO: GRM1555C1E102JA01D
J601 = DF13-6P-1.25V: DF13-6P / 1.25mm Pitch Miniature Crimping Connector.
L1101 L1102 = KNH16C104DA5TS: Kyocera KNH16C104DA5TS EMI filter
R1101 R1102 = RESISTOR0402-RES: as R403 on sheet PX4FMUv2.4.6_04
R1103 R1104 = RESISTOR0402-RES: as R602 on sheet PX4FMUv2.4.6_06
R1105 R1109 R1112 = RESISTOR0402-RES: as R705 on sheet PX4FMUv2.4.6_07
R1106 R1110 R1113 = RESISTOR0402-RES: <b>Resistor</b> / Basic schematic elements and footprints for 0603, 1206, and PTH 1/10th watt (small) resistors.; PARTNO: ERA-2AEB563X
R1107 R1111 R1114 = RESISTOR0402-RES: <b>Resistor</b> / Basic schematic elements and footprints for 0603, 1206, and PTH 1/10th watt (small) resistors.; PARTNO: ERJ-2RKF1053X
R1115 = RESISTOR0402-RES: <b>Resistor</b> / Basic schematic elements and footprints for 0603, 1206, and PTH 1/10th watt (small) resistors.; PARTNO: ERJ-2GE0R00X
RN1101 = 4R-NEXB28V: <b>Array Chip Resistor</b><p> / Source: RS Component / Phycomp; PARTNO: EXB-28V105JX; OC_FARNELL: unknown; OC_NEWARK: unknown
U1101 = LTC4117: PARTNO: LTC4417IUF#PBF
U1102-U1104 = MOSFET-DUAL-PCHANNEL-CHIPFET: PARTNO: NTHD4102PT1G; D: D; S: S; G: G